# EAGLE design Amalgam (EAGLE 7.5.0)

## Sheet 1 of 5
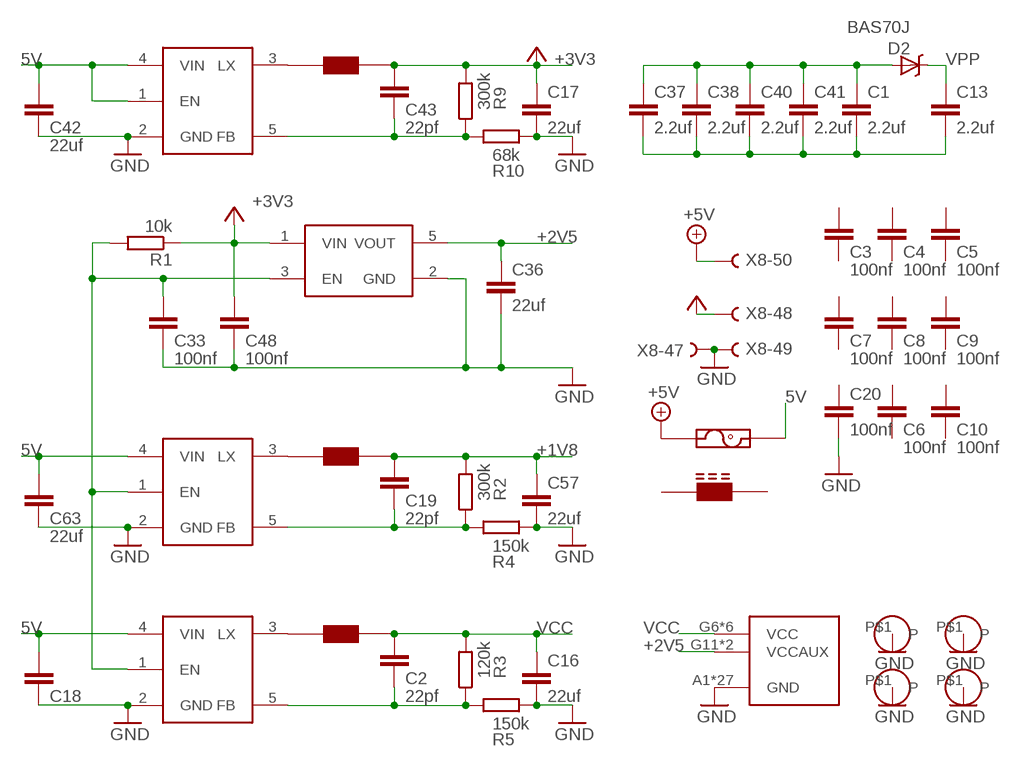
[diagram p0: schematic, sheet 1]

### Parts
C1  2.2uf  C-EUC0603  [C0603]
C2  22pf  C-EUC0402  [C0402]
C3  100nf  C-EUC0402  [C0402]
C4  100nf  C-EUC0402  [C0402]
C5  100nf  C-EUC0402  [C0402]
C6  100nf  C-EUC0402  [C0402]
C7  100nf  C-EUC0402  [C0402]
C8  100nf  C-EUC0402  [C0402]
C9  100nf  C-EUC0402  [C0402]
C10  100nf  C-EUC0402  [C0402]
C13  2.2uf  C-EUC0603  [C0603]
C16  22uf  C-EUC0603  [C0603]
C17  22uf  C-EUC0603  [C0603]
C18  22uf  C-EUC0402  [C0402]
C19  22pf  C-EUC0402  [C0402]
C20  100nf  C-EUC0402  [C0402]
C33  100nf  C-EUC0402  [C0402]
C36  22uf  C-EUC0603  [C0603]
C37  2.2uf  C-EUC0603  [C0603]
C38  2.2uf  C-EUC0603  [C0603]
C40  2.2uf  C-EUC0603  [C0603]
C41  2.2uf  C-EUC0603  [C0603]
C42  22uf  C-EUC0402  [C0402]
C43  22pf  C-EUC0402  [C0402]
C48  100nf  C-EUC0402  [C0402]
C57  22uf  C-EUC0603  [C0603]
C63  22uf  C-EUC0402  [C0402]
D2  BAS70J  [SOD-323]
IC7  NCP114  [TSOP-5/SOT23-5]
R1  10k  R-EU_R0402  [R0402]
R2  300k  R-EU_R0402  [R0402]
R3  120k  R-EU_R0402  [R0402]
R4  150k  R-EU_R0402  [R0402]
R5  150k  R-EU_R0402  [R0402]
R9  300k  R-EU_R0402  [R0402]
R10  68k  R-EU_R0402  [R0402]
U$1  PTC-1206  [1206]
U$7  HOLE-2.5MM  [2.5MM-HOLE]
U$12  AP3429/A  [TSOP-5/SOT23-5]
U$13  AP3429/A  [TSOP-5/SOT23-5]
U$14  LFE5-XX256CABGA256  [CABGA256]
U$15  HOLE-2.5MM  [2.5MM-HOLE]
U$16  HOLE-2.5MM  [2.5MM-HOLE]
U$17  HOLE-2.5MM  [2.5MM-HOLE]
U$18  NRS4018  [NRC4018]
U$19  NRS4018  [NRC4018]
U$20  AP3429/A  [TSOP-5/SOT23-5]
U$21  FERRITE_BEAD1206  [1206]
U$23  NRS4018  [NRC4018]
X8  1296-T50  [1296-50]

### Nets
5V: C18.2 C42.2 C63.2 U$1.2 U$12.4(VIN) U$13.4(VIN) U$20.1(EN) U$20.4(VIN) ; also sheet 5
+1V8: C19.2 C57.1 R2.2 U$19.P$2 ; also sheet 2
+2V5: C36.1 IC7.5(VOUT) U$14.G11(VCCAUX) U$14.L7(VCCAUX)
+3V3: C17.1 C43.2 C48.2 IC7.1(VIN) R1.1 R9.2 U$23.P$2 X8.48 ; also sheet 2,3,4,5
+5V: U$1.1 X8.50 ; also sheet 3,4,5
GND: C16.2 C17.2 C18.1 C20.2 C33.1 C36.2 C42.1 C48.1 C57.2 C63.1 IC7.2(GND) R4.2 R5.2 R10.2 U$7.P$1(P) U$12.2(GND) U$13.2(GND) U$14.A1(GND) U$14.A16(GND) U$14.D2(GND) U$14.D15(GND) U$14.F8(GND) U$14.F9(GND) U$14.G8(GND) U$14.G10(GND) U$14.H1(GND) U$14.H8(GND) U$14.H9(GND) U$14.H10(GND) U$14.H16(GND) U$14.J8(GND) U$14.J9(GND) U$14.J10(GND) U$14.K6(GND) U$14.K7(GND) U$14.K8(GND) U$14.K9(GND) U$14.K10(GND) U$14.N2(GND) U$14.N15(GND) U$14.T1(GND) U$14.T5(GND) U$14.T12(GND) U$14.T16(GND) U$15.P$1(P) U$16.P$1(P) U$17.P$1(P) U$20.2(GND) X8.47 X8.49 ; also sheet 2,3,4,5
N$3: C33.2 IC7.3(EN) R1.2 U$12.1(EN) U$13.1(EN)
N$47: C19.1 R2.1 R4.1 U$12.5(FB)
N$56: U$13.3(LX) U$18.P$1
N$61: U$12.3(LX) U$19.P$1
N$91: C2.1 R3.1 R5.1 U$13.5(FB)
N$93: C43.1 R9.1 R10.1 U$20.5(FB)
N$94: U$20.3(LX) U$23.P$1
N$96: C1.2 C13.2 C37.2 C38.2 C40.2 C41.2
N$97: C1.1 C37.1 C38.1 C40.1 C41.1 D2.A
VCC: C2.2 C16.1 R3.2 U$14.G6(VCC) U$14.G7(VCC) U$14.G9(VCC) U$14.L8(VCC) U$14.L9(VCC) U$14.L10(VCC) U$18.P$2
VPP: C13.1 D2.C
Unconnected: C3.1 C3.2 C4.1 C4.2 C5.1 C5.2 C6.1 C6.2 C7.1 C7.2 C8.1 C8.2 C9.1 C9.2 C10.1 C10.2 C20.1 IC7.4(NC) U$21.1 U$21.2 X8.1 X8.2 X8.3 X8.4 X8.9 X8.10 X8.11 X8.12 X8.18 X8.30 X8.31 X8.32 X8.33 X8.34 X8.35 X8.36 X8.37 X8.38 X8.39 X8.40 X8.41 X8.42 X8.43 X8.44 X8.45 X8.46

## Sheet 2 of 5
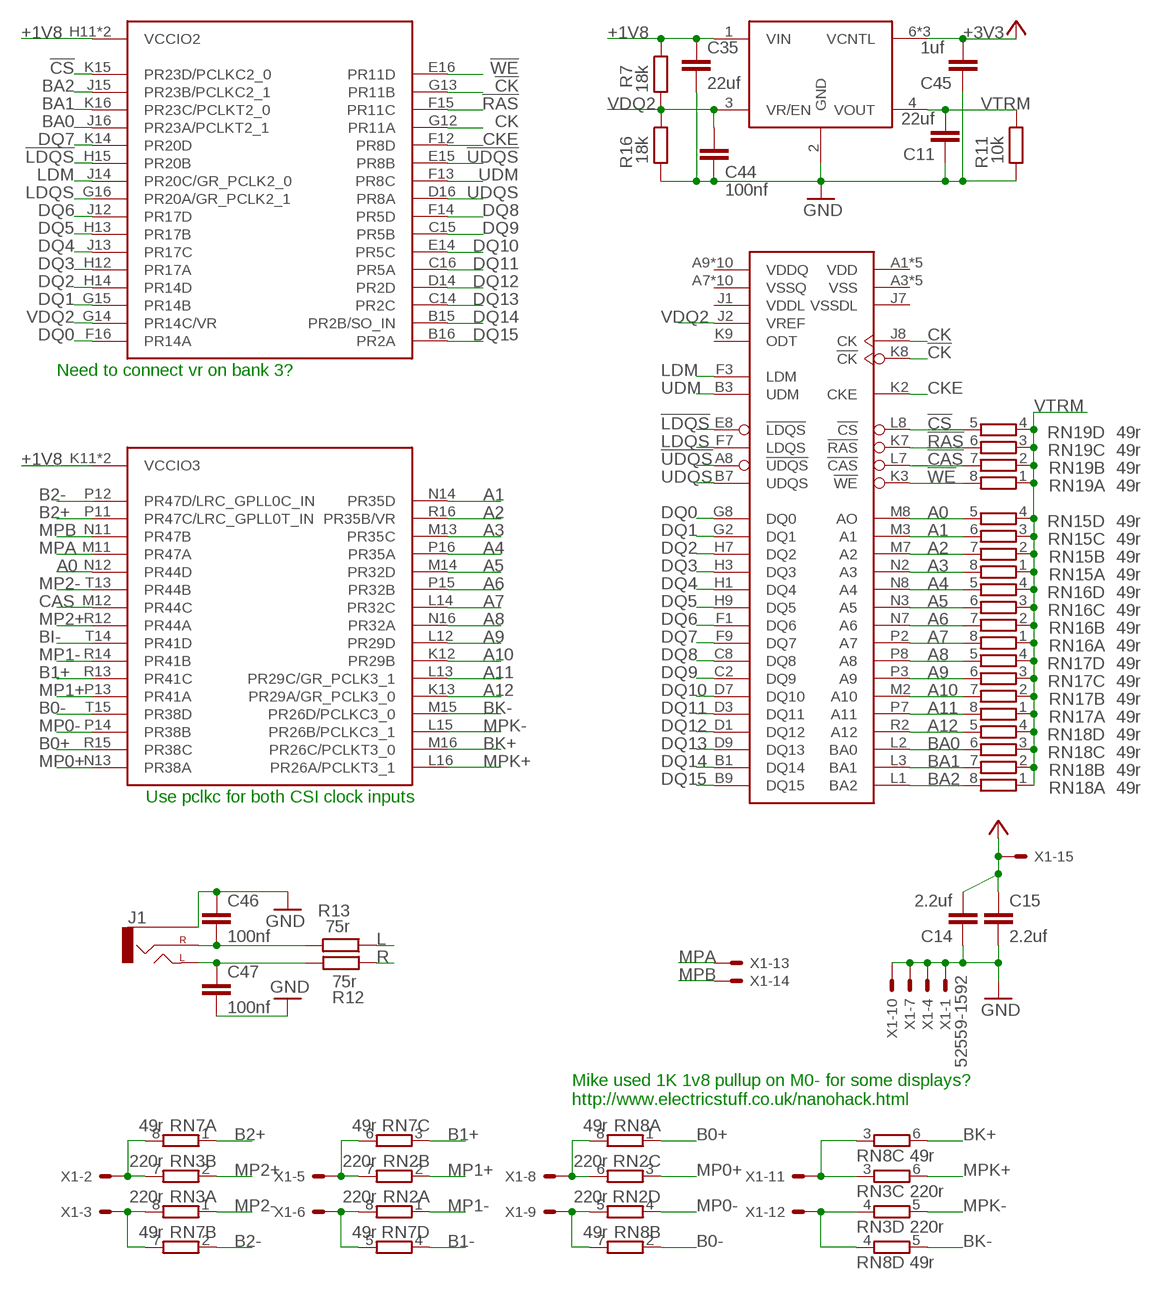
[diagram p1: schematic, sheet 2]

### Parts
C11  22uf  C-EUC0603  [C0603]
C14  2.2uf  C-EUC0603  [C0603]
C15  2.2uf  C-EUC0603  [C0603]
C35  22uf  C-EUC0603  [C0603]
C44  100nf  C-EUC0402  [C0402]
C45  1uf  C-EUC0402  [C0402]
C46  100nf  C-EUC0603  [C0603]
C47  100nf  C-EUC0603  [C0603]
J1  AUDIO_JACK_2.5MM_2.5MM_SMD  [STEREOJACK2.5MM]
R7  18k  R-EU_R0402  [R0402]
R11  10k  R-EU_R0402  [R0402]
R12  75r  R-EU_R0402  [R0402]
R13  75r  R-EU_R0402  [R0402]
R16  18k  R-EU_R0402  [R0402]
RN2  220r  4R-NEXB38V  [EXB38V]
RN3  220r  4R-NEXB38V  [EXB38V]
RN7  49r  4R-NEXB38V  [EXB38V]
RN8  49r  4R-NEXB38V  [EXB38V]
RN15  49r  4R-NEXB38V  [EXB38V]
RN16  49r  4R-NEXB38V  [EXB38V]
RN17  49r  4R-NEXB38V  [EXB38V]
RN18  49r  4R-NEXB38V  [EXB38V]
RN19  49r  4R-NEXB38V  [EXB38V]
U$4  DDR2  [WBGA-84]
U$22  AP2303  [SOIC-8-NARROW]
X1  52559-1592  [52559-1592]

### Nets
!CAS: RN19.7 U$4.L7(!CAS)
!CK: U$4.K8(!CK) U$14.G13(PR11B)
!CS: RN19.5 U$4.L8(!CS) U$14.K15(PR23D/PCLKC2_0)
!LDQS: U$4.E8(!LDQS) U$14.H15(PR20B)
!RAS: RN19.6 U$4.K7(!RAS) U$14.F15(PR11C)
!UDQS: U$4.A8(!UDQS) U$14.E15(PR8B)
!WE: RN19.8 U$4.K3(!WE) U$14.E16(PR11D)
+1V8: C35.1 R7.1 U$14.H11(VCCIO2) U$14.J11(VCCIO2) U$14.K11(VCCIO3) U$14.L11(VCCIO3) U$22.1(VIN) ; also sheet 1
+3V3: C14.2 C15.1 C45.2 U$22.6(VCNTL) U$22.7(VCNTL) U$22.8(VCNTL) X1.15 ; also sheet 1,3,4,5
A0: RN15.5 U$4.M8(AO) U$14.N12(PR44D)
A1: RN15.6 U$4.M3(A1) U$14.N14(PR35D)
A2: RN15.7 U$4.M7(A2) U$14.R16(PR35B/VR)
A3: RN15.8 U$4.N2(A3) U$14.M13(PR35C)
A4: RN16.5 U$4.N8(A4) U$14.P16(PR35A)
A5: RN16.6 U$4.N3(A5) U$14.M14(PR32D)
A6: RN16.7 U$4.N7(A6) U$14.P15(PR32B)
A7: RN16.8 U$4.P2(A7) U$14.L14(PR32C)
A8: RN17.5 U$4.P8(A8) U$14.N16(PR32A)
A9: RN17.6 U$4.P3(A9) U$14.L12(PR29D)
A10: RN17.7 U$4.M2(A10) U$14.K12(PR29B)
A11: RN17.8 U$4.P7(A11) U$14.L13(PR29C/GR_PCLK3_1)
A12: RN18.5 U$4.R2(A12) U$14.K13(PR29A/GR_PCLK3_0)
B0+: RN8.1 U$14.R15(PR38C)
B0-: RN8.2 U$14.T15(PR38D)
B1+: RN7.3 U$14.R13(PR41C)
B1-: RN7.4
B2+: RN7.1 U$14.P11(PR47C/LRC_GPLL0T_IN)
B2-: RN7.2 U$14.P12(PR47D/LRC_GPLL0C_IN)
BA0: RN18.6 U$4.L2(BA0) U$14.J16(PR23A/PCLKT2_1)
BA1: RN18.7 U$4.L3(BA1) U$14.K16(PR23C/PCLKT2_0)
BA2: RN18.8 U$4.L1(BA2) U$14.J15(PR23B/PCLKC2_1)
BI-: U$14.T14(PR41D)
BK+: RN8.6 U$14.M16(PR26C/PCLKT3_0)
BK-: RN8.5 U$14.M15(PR26D/PCLKC3_0)
CAS: U$14.M12(PR44C)
CK: U$4.J8(CK) U$14.G12(PR11A)
CKE: U$4.K2(CKE) U$14.F12(PR8D)
DQ0: U$4.G8(DQ0) U$14.F16(PR14A)
DQ1: U$4.G2(DQ1) U$14.G15(PR14B)
DQ2: U$4.H7(DQ2) U$14.H14(PR14D)
DQ3: U$4.H3(DQ3) U$14.H12(PR17A)
DQ4: U$4.H1(DQ4) U$14.J13(PR17C)
DQ5: U$4.H9(DQ5) U$14.H13(PR17B)
DQ6: U$4.F1(DQ6) U$14.J12(PR17D)
DQ7: U$4.F9(DQ7) U$14.K14(PR20D)
DQ8: U$4.C8(DQ8) U$14.F14(PR5D)
DQ9: U$4.C2(DQ9) U$14.C15(PR5B)
DQ10: U$4.D7(DQ10) U$14.E14(PR5C)
DQ11: U$4.D3(DQ11) U$14.C16(PR5A)
DQ12: U$4.D1(DQ12) U$14.D14(PR2D)
DQ13: U$4.D9(DQ13) U$14.C14(PR2C)
DQ14: U$4.B1(DQ14) U$14.B15(PR2B/SO_IN)
DQ15: U$4.B9(DQ15) U$14.B16(PR2A)
GND: C11.1 C14.1 C15.2 C35.2 C44.1 C45.1 C46.1 C47.2 J1.5(SLEEVE) R11.2 R16.2 U$22.2(GND) X1.1 X1.4 X1.7 X1.10 ; also sheet 1,3,4,5
L: R13.1 ; also sheet 5
LDM: U$4.F3(LDM) U$14.J14(PR20C/GR_PCLK2_0)
LDQS: U$4.F7(LDQS) U$14.G16(PR20A/GR_PCLK2_1)
MP0+: RN2.3 U$14.N13(PR38A)
MP0-: RN2.4 U$14.P14(PR38B)
MP1+: RN2.2 U$14.P13(PR41A)
MP1-: RN2.1 U$14.R14(PR41B)
MP2+: RN3.2 U$14.R12(PR44A)
MP2-: RN3.1 U$14.T13(PR44B)
MPA: U$14.M11(PR47A) X1.13
MPB: U$14.N11(PR47B) X1.14
MPK+: RN3.6 U$14.L16(PR26A/PCLKT3_1)
MPK-: RN3.5 U$14.L15(PR26B/PCLKC3_1)
N$8: RN3.3 RN8.3 X1.11
N$9: RN3.4 RN8.4 X1.12
N$19: RN2.6 RN8.8 X1.8
N$20: RN2.5 RN8.7 X1.9
N$22: RN2.7 RN7.6 X1.5
N$25: RN2.8 RN7.5 X1.6
N$26: RN3.8 RN7.7 X1.3
N$30: RN3.7 RN7.8 X1.2
N$92: C46.2 J1.4(RIGHT) R13.2
N$98: C47.1 J1.1(LEFT) R12.1
R: R12.2 ; also sheet 5
UDM: U$4.B3(UDM) U$14.F13(PR8C)
UDQS: U$4.B7(UDQS) U$14.D16(PR8A)
VDQ2: C44.2 R7.2 R16.1 U$4.J2(VREF) U$14.G14(PR14C/VR) U$22.3(VR/EN)
VTRM: C11.2 R11.1 RN15.1 RN15.2 RN15.3 RN15.4 RN16.1 RN16.2 RN16.3 RN16.4 RN17.1 RN17.2 RN17.3 RN17.4 RN18.1 RN18.2 RN18.3 RN18.4 RN19.1 RN19.2 RN19.3 RN19.4 U$22.4(VOUT)
Unconnected: U$4.A1(VDD) U$4.A2(NC) U$4.A3(VSS) U$4.A7(VSSQ) U$4.A9(VDDQ) U$4.B2(VSSQ) U$4.B8(VSSQ) U$4.C1(VDDQ) U$4.C3(VDDQ) U$4.C7(VDDQ) U$4.C9(VDDQ) U$4.D2(VSSQ) U$4.D8(VSSQ) U$4.E1(VDD) U$4.E2(NC) U$4.E3(VSS) U$4.E7(VSSQ) U$4.E9(VDDQ) U$4.F2(VSSQ) U$4.F8(VSSQ) U$4.G1(VDDQ) U$4.G3(VDDQ) U$4.G7(VDDQ) U$4.G9(VDDQ) U$4.H2(VSSQ) U$4.H8(VSSQ) U$4.J1(VDDL) U$4.J3(VSS) U$4.J7(VSSDL) U$4.J9(VDD) U$4.K9(ODT) U$4.M9(VDD) U$4.N1(VSS) U$4.P9(VSS) U$4.R1(VDD) U$4.R3(NC) U$4.R7(NC) U$4.R8(NC) U$22.5(NC)

### Notes on the sheet
- Need to connect vr on bank 3?
- Use pclkc for both CSI clock inputs
- Mike used 1K 1v8 pullup on M0- for some displays?
  http://www.electricstuff.co.uk/nanohack.html

## Sheet 3 of 5
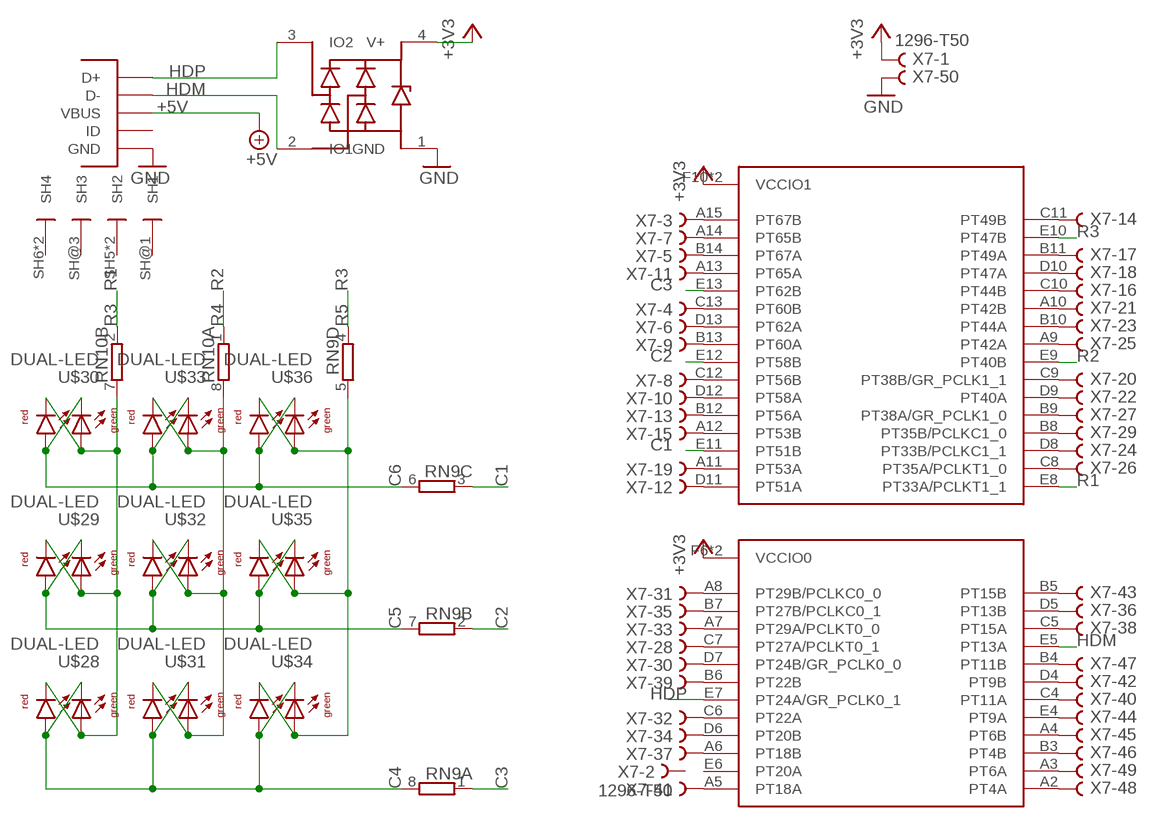
[diagram p2: schematic, sheet 3]

### Parts
ESD1  PRTR5V0U2X  [SOT143B]
RN9  4R-NEXB38V  [EXB38V]
RN10  4R-NEXB38V  [EXB38V]
U$11  FCI-MICROUSB-B-PEG  [MICROUSB-B-PEG]
U$28  DUAL-LED  [DUAL-0603]
U$29  DUAL-LED  [DUAL-0603]
U$30  DUAL-LED  [DUAL-0603]
U$31  DUAL-LED  [DUAL-0603]
U$32  DUAL-LED  [DUAL-0603]
U$33  DUAL-LED  [DUAL-0603]
U$34  DUAL-LED  [DUAL-0603]
U$35  DUAL-LED  [DUAL-0603]
U$36  DUAL-LED  [DUAL-0603]
X7  1296-T50  [1296-50]

### Nets
+3V3: ESD1.4(V+) U$14.F6(VCCIO0) U$14.F7(VCCIO0) U$14.F10(VCCIO1) U$14.F11(VCCIO1) X7.1 ; also sheet 1,2,4,5
+5V: U$11.P$1(VBUS) ; also sheet 1,4,5
C1: RN9.3 U$14.E11(PT51B)
C2: RN9.2 U$14.E12(PT58B)
C3: RN9.1 U$14.E13(PT62B)
C4: RN9.8 U$28.A1(AR) U$28.C2(CG) U$31.A1(AR) U$31.C2(CG) U$34.A1(AR) U$34.C2(CG)
C5: RN9.7 U$29.A1(AR) U$29.C2(CG) U$32.A1(AR) U$32.C2(CG) U$35.A1(AR) U$35.C2(CG)
C6: RN9.6 U$30.A1(AR) U$30.C2(CG) U$33.A1(AR) U$33.C2(CG) U$36.A1(AR) U$36.C2(CG)
GND: ESD1.1(GND) U$11.P$5(GND) X7.50 ; also sheet 1,2,4,5
HDM: ESD1.2(IO1) U$11.P$2(D-) U$14.E5(PT13A)
HDP: ESD1.3(IO2) U$11.P$3(D+) U$14.E7(PT24A/GR_PCLK0_1)
N$5: U$14.B3(PT4B) X7.46
N$39: U$14.A2(PT4A) X7.48
N$40: U$14.A15(PT67B) X7.3
N$51: U$14.B14(PT67A) X7.5
N$52: U$14.A14(PT65B) X7.7
N$69: U$14.B13(PT60A) X7.9
N$70: U$14.A13(PT65A) X7.11
N$71: U$14.B12(PT56A) X7.13
N$72: U$14.A12(PT53B) X7.15
N$73: U$14.B11(PT49A) X7.17
N$74: U$14.A11(PT53A) X7.19
N$75: U$14.C13(PT60B) X7.4
N$76: U$14.D13(PT62A) X7.6
N$77: U$14.C12(PT56B) X7.8
N$78: U$14.D12(PT58A) X7.10
N$79: U$14.A8(PT29B/PCLKC0_0) X7.31
N$80: U$14.A7(PT29A/PCLKT0_0) X7.33
N$81: U$14.B7(PT27B/PCLKC0_1) X7.35
N$82: U$14.A6(PT18B) X7.37
N$83: U$14.B6(PT22B) X7.39
N$84: U$14.A5(PT18A) X7.41
N$85: U$14.B5(PT15B) X7.43
N$86: U$14.C7(PT27A/PCLKT0_1) X7.28
N$87: U$14.D7(PT24B/GR_PCLK0_0) X7.30
N$88: U$14.C6(PT22A) X7.32
N$89: U$14.D6(PT20B) X7.34
N$90: U$14.D5(PT13B) X7.36
N$106: U$14.B4(PT11B) X7.47
N$107: U$14.A4(PT6B) X7.45
N$108: U$14.A3(PT6A) X7.49
N$130: U$14.D11(PT51A) X7.12
N$131: U$14.C11(PT49B) X7.14
N$132: U$14.C10(PT44B) X7.16
N$133: U$14.D10(PT47A) X7.18
N$134: U$14.A10(PT42B) X7.21
N$135: U$14.B10(PT44A) X7.23
N$136: U$14.A9(PT42A) X7.25
N$137: U$14.B9(PT38A/GR_PCLK1_0) X7.27
N$138: U$14.B8(PT35B/PCLKC1_0) X7.29
N$139: U$14.C9(PT38B/GR_PCLK1_1) X7.20
N$140: U$14.D9(PT40A) X7.22
N$141: U$14.D8(PT33B/PCLKC1_1) X7.24
N$142: U$14.C8(PT35A/PCLKT1_0) X7.26
N$143: U$14.C5(PT15A) X7.38
N$144: U$14.C4(PT11A) X7.40
N$145: U$14.D4(PT9B) X7.42
N$146: U$14.E4(PT9A) X7.44
R1: RN10.2 U$14.E8(PT33A/PCLKT1_1)
R2: RN10.1 U$14.E9(PT40B)
R3: RN9.4 RN10.7 U$14.E10(PT47B) U$28.A2(AG) U$28.C1(CR) U$29.A2(AG) U$29.C1(CR) U$30.A2(AG) U$30.C1(CR)
R4: RN10.8 U$31.A2(AG) U$31.C1(CR) U$32.A2(AG) U$32.C1(CR) U$33.A2(AG) U$33.C1(CR)
R5: RN9.5 U$34.A2(AG) U$34.C1(CR) U$35.A2(AG) U$35.C1(CR) U$36.A2(AG) U$36.C1(CR)
Unconnected: RN10.3 RN10.4 RN10.5 RN10.6 U$11.P$4(ID) U$11.SH5(SH2) U$11.SH6(SH4) U$11.SH@1(SH1) U$11.SH@2(SH2) U$11.SH@3(SH3) U$11.SH@4(SH4) U$14.E6(PT20A) X7.2

## Sheet 4 of 5
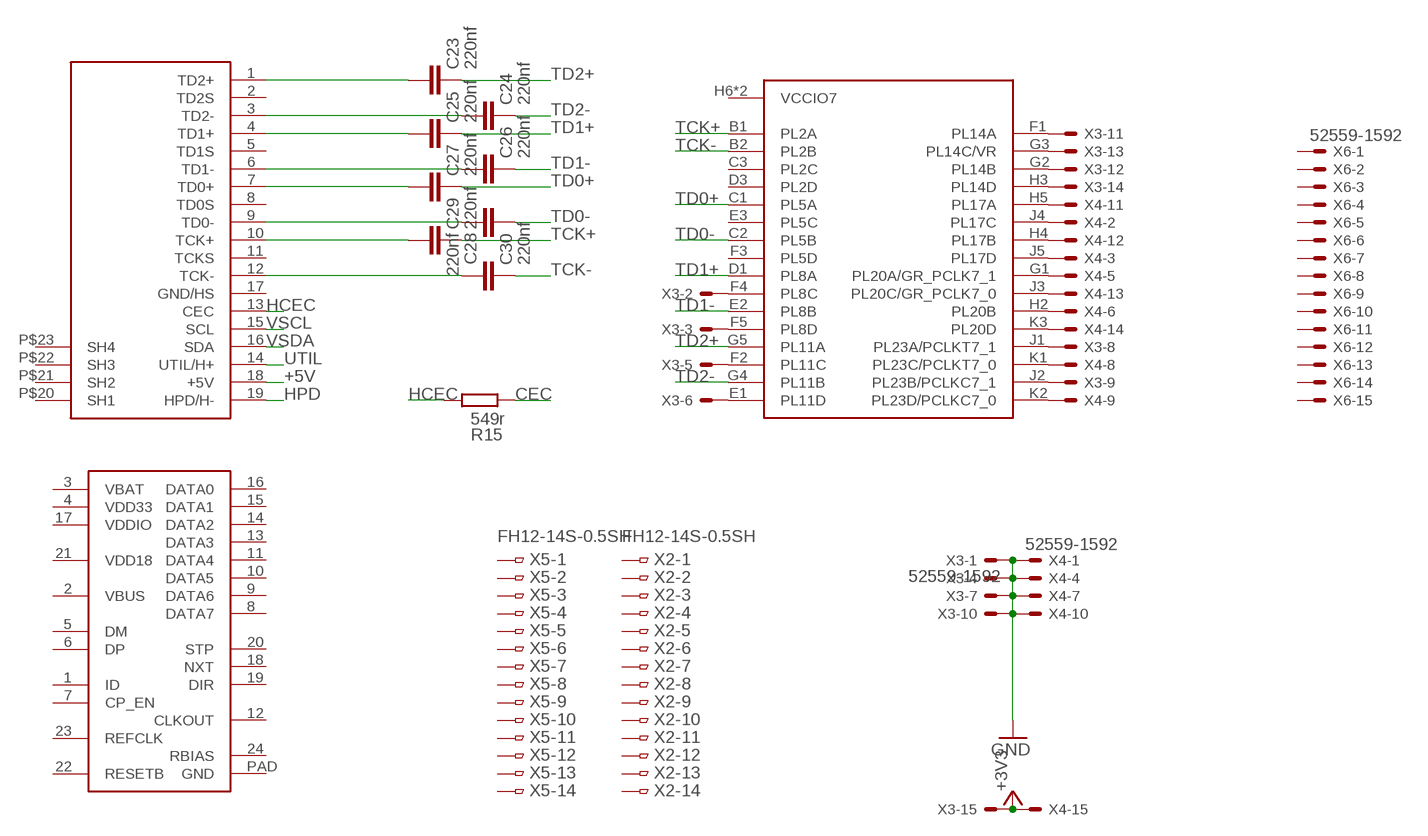
[diagram p3: schematic, sheet 4]

### Parts
C23  220nf  C-EUC0402  [C0402]
C24  220nf  C-EUC0402  [C0402]
C25  220nf  C-EUC0402  [C0402]
C26  220nf  C-EUC0402  [C0402]
C27  220nf  C-EUC0402  [C0402]
C28  220nf  C-EUC0402  [C0402]
C29  220nf  C-EUC0402  [C0402]
C30  220nf  C-EUC0402  [C0402]
R15  549r  R-EU_R0402  [R0402]
U$9  HD10-001_HDMIMINI-HDMI  [MINI-HDMI]
U$25  USB3318-QFN24  [24-QFN]
X2  FH12-14S-0.5SH  [FH12-14S-0.5SH]
X3  52559-1592  [52559-1592]
X4  52559-1592  [52559-1592]
X5  FH12-14S-0.5SH  [FH12-14S-0.5SH]
X6  52559-1592  [52559-1592]

### Nets
+3V3: X3.15 X4.15 ; also sheet 1,2,3,5
+5V: U$9.18(+5V) ; also sheet 1,3,5
CEC: R15.2 ; also sheet 5
GND: X3.1 X3.4 X3.7 X3.10 X4.1 X4.4 X4.7 X4.10 ; also sheet 1,2,3,5
HCEC: R15.1 U$9.13(CEC)
HPD: U$9.19(HPD/H-) ; also sheet 5
N$6: U$14.K3(PL20D) X4.14
N$11: U$14.J3(PL20C/GR_PCLK7_0) X4.13
N$13: U$14.J1(PL23A/PCLKT7_1) X3.8
N$14: U$14.J2(PL23B/PCLKC7_1) X3.9
N$15: U$14.K1(PL23C/PCLKT7_0) X4.8
N$16: U$14.K2(PL23D/PCLKC7_0) X4.9
N$17: U$14.H2(PL20B) X4.6
N$21: U$14.G1(PL20A/GR_PCLK7_1) X4.5
N$23: U$14.J5(PL17D) X4.3
N$24: U$14.J4(PL17C) X4.2
N$27: U$14.H4(PL17B) X4.12
N$28: U$14.H5(PL17A) X4.11
N$29: U$14.H3(PL14D) X3.14
N$31: U$14.G3(PL14C/VR) X3.13
N$32: U$14.G2(PL14B) X3.12
N$33: U$14.F1(PL14A) X3.11
N$34: U$14.E1(PL11D) X3.6
N$35: U$14.F2(PL11C) X3.5
N$36: U$14.F5(PL8D) X3.3
N$42: C23.2 U$9.1(TD2+)
N$44: C24.2 U$9.3(TD2-)
N$45: C25.2 U$9.4(TD1+)
N$49: C26.2 U$9.6(TD1-)
N$50: C27.2 U$9.7(TD0+)
N$54: C28.1 U$9.9(TD0-)
N$55: C29.2 U$9.10(TCK+)
N$57: U$14.F4(PL8C) X3.2
N$58: C30.2 U$9.12(TCK-)
TCK+: C29.1 U$14.B1(PL2A)
TCK-: C30.1 U$14.B2(PL2B)
TD0+: C27.1 U$14.C1(PL5A)
TD0-: C28.2 U$14.C2(PL5B)
TD1+: C25.1 U$14.D1(PL8A)
TD1-: C26.1 U$14.E2(PL8B)
TD2+: C23.1 U$14.G5(PL11A)
TD2-: C24.1 U$14.G4(PL11B)
UTIL: U$9.14(UTIL/H+)
VSCL: U$9.15(SCL) ; also sheet 5
VSDA: U$9.16(SDA) ; also sheet 5
Unconnected: U$9.2(TD2S) U$9.5(TD1S) U$9.8(TD0S) U$9.11(TCKS) U$9.17(GND/HS) U$9.P$20(SH1) U$9.P$21(SH2) U$9.P$22(SH3) U$9.P$23(SH4) U$14.C3(PL2C) U$14.D3(PL2D) U$14.E3(PL5C) U$14.F3(PL5D) U$14.H6(VCCIO7) U$14.H7(VCCIO7) U$25.1(ID) U$25.2(VBUS) U$25.5(DM) U$25.6(DP) U$25.7(CP_EN) U$25.8(DATA7) U$25.9(DATA6) U$25.10(DATA5) U$25.11(DATA4) U$25.12(CLKOUT) U$25.13(DATA3) U$25.14(DATA2) U$25.15(DATA1) U$25.16(DATA0) U$25.18(NXT) U$25.19(DIR) U$25.20(STP) U$25.22(RESETB) U$25.23(REFCLK) U$25.24(RBIAS) X2.1 X2.2 X2.3 X2.4 X2.5 X2.6 X2.7 X2.8 X2.9 X2.10 X2.11 X2.12 X2.13 X2.14 X5.1 X5.2 X5.3 X5.4 X5.5 X5.6 X5.7 X5.8 X5.9 X5.10 X5.11 X5.12 X5.13 X5.14 X6.1 X6.2 X6.3 X6.4 X6.5 X6.6 X6.7 X6.8 X6.9 X6.10 X6.11 X6.12 X6.13 X6.14 X6.15

## Sheet 5 of 5
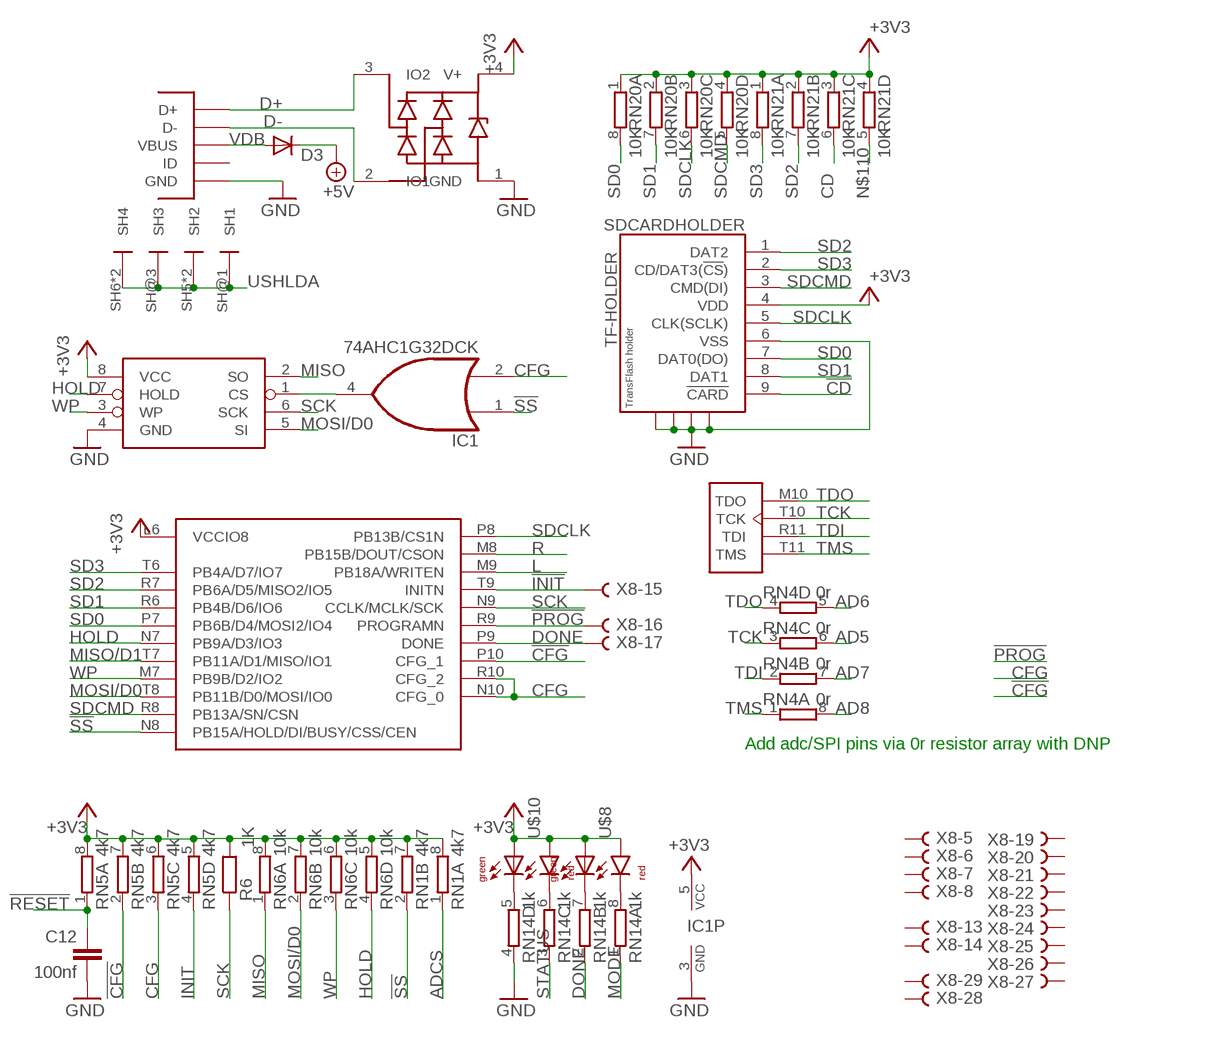
[diagram p4: schematic, sheet 5, part 1 of 2]
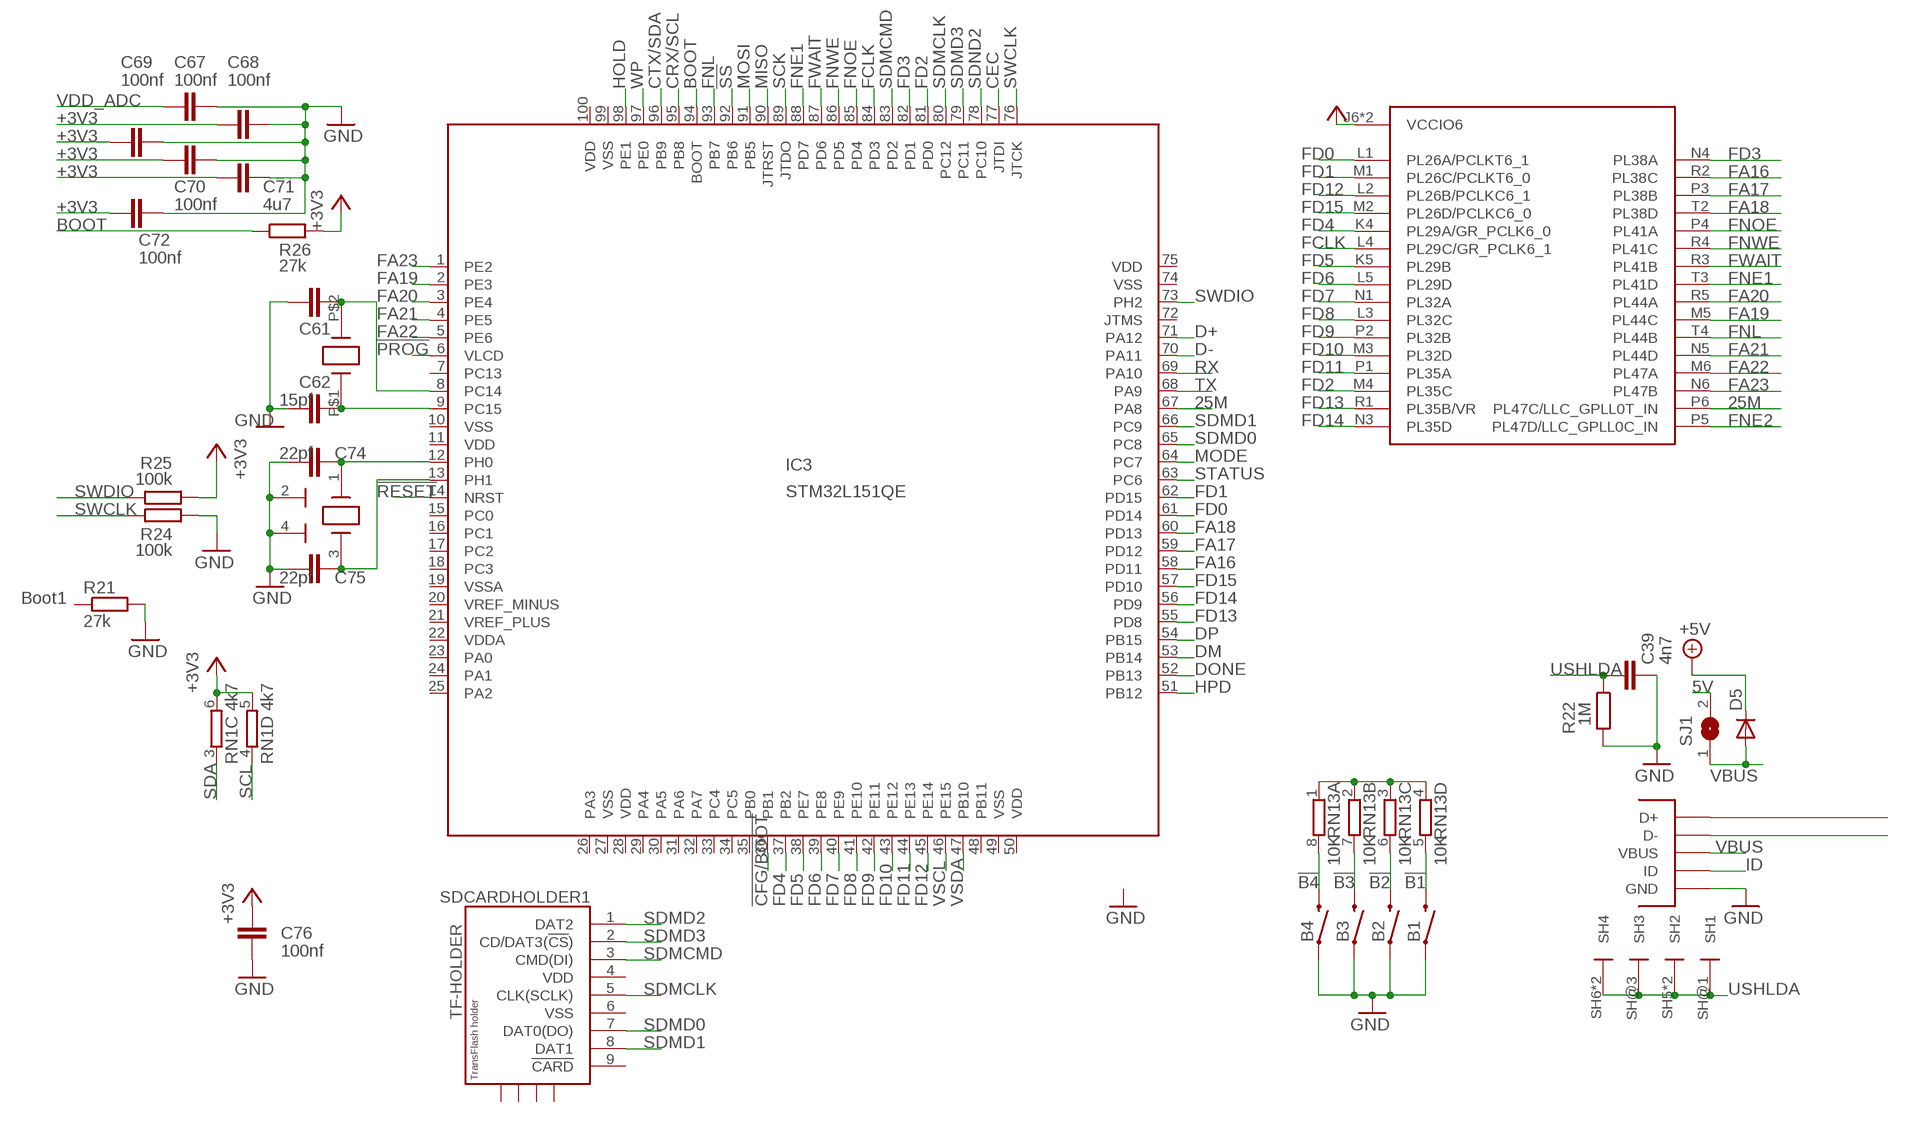
[diagram p5: schematic, sheet 5, part 2 of 2]

### Parts
B1  RS SWITCH  SWITCH-MOMENTARY-2SMD-1101NE  [TACTILE-SWITCH-1101NE]
B2  RS SWITCH  SWITCH-MOMENTARY-2SMD-1101NE  [TACTILE-SWITCH-1101NE]
B3  RS SWITCH  SWITCH-MOMENTARY-2SMD-1101NE  [TACTILE-SWITCH-1101NE]
B4  RS SWITCH  SWITCH-MOMENTARY-2SMD-1101NE  [TACTILE-SWITCH-1101NE]
C12  100nf  C-EUC0402  [C0402]
C39  4n7  C-EUC0402  [C0402]
C61  15pf  C-EUC0402  [C0402]
C62  15pf  C-EUC0402  [C0402]
C67  100nf  C-EUC0402  [C0402]
C68  100nf  C-EUC0402  [C0402]
C69  100nf  C-EUC0402  [C0402]
C70  100nf  C-EUC0402  [C0402]
C71  4u7  C-EUC0402  [C0402]
C72  100nf  C-EUC0402  [C0402]
C74  22pf  C-EUC0402  [C0402]
C75  22pf  C-EUC0402  [C0402]
C76  100nf  C-EUC0402  [C0402]
D3  DIODE-SOD123  [SOD123]
D5  DIODE-SOD123  [SOD123]
ESD2  PRTR5V0U2X  [SOT143B]
IC1  74AHC1G32DCK  [SC70-5]
IC3  STM32L151QE  [LQFP100_14X14]
R6  1K  R-EU_R0402  [R0402]
R21  27k  R-EU_R0402  [R0402]
R22  1M  R-EU_R0402  [R0402]
R24  100k  R-EU_R0402  [R0402]
R25  100k  R-EU_R0402  [R0402]
R26  27k  R-EU_R0402  [R0402]
RN1  4k7  4R-NEXB38V  [EXB38V]
RN4  0r  4R-NEXB38V  [EXB38V]
RN5  4k7  4R-NEXB38V  [EXB38V]
RN6  10k  4R-NEXB38V  [EXB38V]
RN13  10K  4R-NEXB38V  [EXB38V]
RN14  1k  4R-NEXB38V  [EXB38V]
RN20  10K  4R-NEXB38V  [EXB38V]
RN21  10K  4R-NEXB38V  [EXB38V]
SDCARDHOLDER  TF-HOLDER  [TF-PULL]
SDCARDHOLDER1  TF-HOLDER  [TF-PULL]
SJ1  SJ  [SJ]
U$2  AT25SDF041A  [SOIC-8-NARROW]
U$3  FC-135  [FC135]
U$5  FCI-MICROUSB-B-PEG  [MICROUSB-B-PEG]
U$6  FCI-MICROUSB-B-PEG  [MICROUSB-B-PEG]
U$8  DUAL-LED  [DUAL-0603]
U$10  DUAL-LED  [DUAL-0603]
Y3  12MZ  7M-25  [CRYSTAL-3.2X2.5]

### Nets
5V: SJ1.2 ; also sheet 1
25M: IC3.67(PA8) U$14.P6(PL47C/LLC_GPLL0T_IN)
!B1: B1.2 RN13.5
!B2: B2.2 RN13.6
!B3: B3.2 RN13.7
!B4: B4.2 RN13.8
!CD: SDCARDHOLDER.9(!CARD)
!CFG: RN5.2 U$14.P10(CFG_1)
!CFG/BOOT: IC3.36(PB1)
!INIT: U$14.T9(INITN) X8.15
!PROG: IC3.6(VLCD) U$14.R9(PROGRAMN) X8.16
!RESET: C12.1 IC3.14(NRST) RN5.1
!SS: IC1.1(I0) IC3.92(PB6) RN1.2 U$14.N8(PB15A/HOLD/DI/BUSY/CSS/CEN)
+3V3: C68.2 C69.2 C70.2 C71.2 C72.2 C76.1 ESD2.4(V+) IC1.5(VCC) R6.2 R25.1 R26.2 RN1.5 RN1.6 RN1.7 RN1.8 RN5.5 RN5.6 RN5.7 RN5.8 RN6.5 RN6.6 RN6.7 RN6.8 RN20.1 RN20.2 RN20.3 RN20.4 RN21.1 RN21.2 RN21.3 RN21.4 SDCARDHOLDER.4(VDD) U$2.8(VCC) U$8.A1(AR) U$8.A2(AG) U$10.A1(AR) U$10.A2(AG) U$14.J6(VCCIO6) U$14.J7(VCCIO6) U$14.L6(VCCIO8) ; also sheet 1,2,3,4
+5V: D3.C D5.C ; also sheet 1,3,4
AD5: RN4.6
AD6: RN4.5
AD7: RN4.7
AD8: RN4.8
ADCS: RN1.1
BOOT: IC3.94(BOOT) R26.1
CD: RN21.6
CEC: IC3.77(JTDI) ; also sheet 4
CFG: IC1.2(I1) RN5.3 U$14.N10(CFG_0) U$14.R10(CFG_2)
CRX/SCL: IC3.95(PB8)
CTX/SDA: IC3.96(PB9)
D+: ESD2.3(IO2) IC3.71(PA12) U$5.P$3(D+)
D-: ESD2.2(IO1) IC3.70(PA11) U$5.P$2(D-)
DM: IC3.53(PB14)
DONE: IC3.52(PB13) RN14.2 U$14.P9(DONE) X8.17
DP: IC3.54(PB15)
FA16: IC3.58(PD11) U$14.R2(PL38C)
FA17: IC3.59(PD12) U$14.P3(PL38B)
FA18: IC3.60(PD13) U$14.T2(PL38D)
FA19: IC3.2(PE3) U$14.M5(PL44C)
FA20: IC3.3(PE4) U$14.R5(PL44A)
FA21: IC3.4(PE5) U$14.N5(PL44D)
FA22: IC3.5(PE6) U$14.M6(PL47A)
FA23: IC3.1(PE2) U$14.N6(PL47B)
FCLK: IC3.84(PD3) U$14.L4(PL29C/GR_PCLK6_1)
FD0: IC3.61(PD14) U$14.L1(PL26A/PCLKT6_1)
FD1: IC3.62(PD15) U$14.M1(PL26C/PCLKT6_0)
FD2: IC3.81(PD0) U$14.M4(PL35C)
FD3: IC3.82(PD1) U$14.N4(PL38A)
FD4: IC3.37(PB2) U$14.K4(PL29A/GR_PCLK6_0)
FD5: IC3.38(PE7) U$14.K5(PL29B)
FD6: IC3.39(PE8) U$14.L5(PL29D)
FD7: IC3.40(PE9) U$14.N1(PL32A)
FD8: IC3.41(PE10) U$14.L3(PL32C)
FD9: IC3.42(PE11) U$14.P2(PL32B)
FD10: IC3.43(PE12) U$14.M3(PL32D)
FD11: IC3.44(PE13) U$14.P1(PL35A)
FD12: IC3.45(PE14) U$14.L2(PL26B/PCLKC6_1)
FD13: IC3.55(PD8) U$14.R1(PL35B/VR)
FD14: IC3.56(PD9) U$14.N3(PL35D)
FD15: IC3.57(PD10) U$14.M2(PL26D/PCLKC6_0)
FNE1: IC3.88(PD7) U$14.T3(PL41D)
FNE2: U$14.P5(PL47D/LLC_GPLL0C_IN)
FNL: IC3.93(PB7) U$14.T4(PL44B)
FNOE: IC3.85(PD4) U$14.P4(PL41A)
FNWE: IC3.86(PD5) U$14.R4(PL41C)
FWAIT: IC3.87(PD6) U$14.R3(PL41B)
GND: B1.1 B2.1 B3.1 B4.1 C12.2 C39.1 C61.1 C62.1 C67.1 C68.1 C69.1 C70.1 C71.1 C72.1 C74.1 C75.1 C76.2 ESD2.1(GND) IC1.3(GND) R21.2 R22.2 R24.1 RN14.4 SDCARDHOLDER.6(VSS) SDCARDHOLDER.S1 SDCARDHOLDER.S2 SDCARDHOLDER.S3 SDCARDHOLDER.S4 U$2.4(GND) U$5.P$5(GND) U$6.P$5(GND) Y3.2(GND) Y3.4(GND) ; also sheet 1,2,3,4
HOLD: IC3.98(PE1) RN6.4 U$2.7(HOLD) U$14.N7(PB9A/D3/IO3)
HPD: IC3.51(PB12) ; also sheet 4
ID: U$6.P$4(ID)
INIT: RN5.4
L: U$14.M9(PB18A/WRITEN) ; also sheet 2
MISO: IC3.90(JTRST) RN6.1 U$2.2(SO)
MISO/D1: U$14.T7(PB11A/D1/MISO/IO1)
MODE: IC3.64(PC7) RN14.1
MOSI: IC3.91(PB5)
MOSI/D0: RN6.2 U$2.5(SI) U$14.T8(PB11B/D0/MOSI/IO0)
N$1: C62.2 IC3.9(PC15) U$3.P$1(X1)
N$4: IC1.4(O) U$2.1(CS)
N$10: RN13.1 RN13.2 RN13.3 RN13.4
N$12: C61.2 IC3.8(PC14) U$3.P$2(X2)
N$18: U$6.P$3(D+)
N$41: U$6.P$2(D-)
N$43: RN14.5 U$10.C2(CG)
N$46: RN14.6 U$10.C1(CR)
N$48: RN14.7 U$8.C2(CG)
N$53: RN14.8 U$8.C1(CR)
N$60: C75.2 IC3.13(PH1) Y3.3(X2)
N$63: C74.2 IC3.12(PH0) Y3.1(X1)
N$110: RN21.5
R: U$14.M8(PB15B/DOUT/CSON) ; also sheet 2
RX: IC3.69(PA10)
SCK: IC3.89(JTDO) R6.1 U$2.6(SCK) U$14.N9(CCLK/MCLK/SCK)
SCL: RN1.4
SD0: RN20.8 SDCARDHOLDER.7(DAT0(DO)) U$14.P7(PB6B/D4/MOSI2/IO4)
SD1: RN20.7 SDCARDHOLDER.8(DAT1) U$14.R6(PB4B/D6/IO6)
SD2: RN21.7 SDCARDHOLDER.1(DAT2) U$14.R7(PB6A/D5/MISO2/IO5)
SD3: RN21.8 SDCARDHOLDER.2(CD/DAT3(!CS!)) U$14.T6(PB4A/D7/IO7)
SDA: RN1.3
SDCLK: RN20.6 SDCARDHOLDER.5(CLK(SCLK)) U$14.P8(PB13B/CS1N)
SDCMD: RN20.5 SDCARDHOLDER.3(CMD(DI)) U$14.R8(PB13A/SN/CSN)
SDMCLK: IC3.80(PC12) SDCARDHOLDER1.5(CLK(SCLK))
SDMCMD: IC3.83(PD2) SDCARDHOLDER1.3(CMD(DI))
SDMD0: IC3.65(PC8) SDCARDHOLDER1.7(DAT0(DO))
SDMD1: IC3.66(PC9) SDCARDHOLDER1.8(DAT1)
SDMD2: SDCARDHOLDER1.1(DAT2)
SDMD3: IC3.79(PC11) SDCARDHOLDER1.2(CD/DAT3(!CS!))
SDND2: IC3.78(PC10)
STATUS: IC3.63(PC6) RN14.3
SWCLK: IC3.76(JTCK) R24.2
SWDIO: IC3.73(PH2) R25.2
TCK: RN4.3 U$14.T10(TCK)
TDI: RN4.2 U$14.R11(TDI)
TDO: RN4.4 U$14.M10(TDO)
TMS: RN4.1 U$14.T11(TMS)
TX: IC3.68(PA9)
USHLDA: C39.2 R22.1 U$5.SH5(SH2) U$5.SH6(SH4) U$5.SH@1(SH1) U$5.SH@2(SH2) U$5.SH@3(SH3) U$5.SH@4(SH4) U$6.SH5(SH2) U$6.SH6(SH4) U$6.SH@1(SH1) U$6.SH@2(SH2) U$6.SH@3(SH3) U$6.SH@4(SH4)
VBUS: D5.A SJ1.1 U$6.P$1(VBUS)
VDB: D3.A U$5.P$1(VBUS)
VDD_ADC: C67.2
VSCL: IC3.46(PE15) ; also sheet 4
VSDA: IC3.47(PB10) ; also sheet 4
WP: IC3.97(PE0) RN6.3 U$2.3(WP) U$14.M7(PB9B/D2/IO2)
Unconnected: IC3.7(PC13) IC3.15(PC0) IC3.16(PC1) IC3.17(PC2) IC3.18(PC3) IC3.20(VREF_MINUS) IC3.21(VREF_PLUS) IC3.23(PA0) IC3.24(PA1) IC3.25(PA2) IC3.26(PA3) IC3.29(PA4) IC3.30(PA5) IC3.31(PA6) IC3.32(PA7) IC3.33(PC4) IC3.34(PC5) IC3.35(PB0) IC3.48(PB11) IC3.72(JTMS) R21.1 SDCARDHOLDER1.9(!CARD) SDCARDHOLDER1.S1 SDCARDHOLDER1.S2 SDCARDHOLDER1.S3 SDCARDHOLDER1.S4 U$5.P$4(ID) X8.5 X8.6 X8.7 X8.8 X8.13 X8.14 X8.19 X8.20 X8.21 X8.22 X8.23 X8.24 X8.25 X8.26 X8.27 X8.28 X8.29

### Notes on the sheet
- Boot1
- Add adc/SPI pins via 0r resistor array with DNP

## Power pins joined to a net without a drawn wire
GND: U$25.PAD(GND)
VBAT: U$25.3(VBAT)
VDD: IC3.11(VDD) IC3.28(VDD) IC3.50(VDD) IC3.75(VDD) IC3.100(VDD) SDCARDHOLDER1.4(VDD)
VDD18: U$25.21(VDD18)
VDD33: U$25.4(VDD33)
VDDA: IC3.22(VDDA)
VDDIO: U$25.17(VDDIO)
VSS: IC3.10(VSS) IC3.27(VSS) IC3.49(VSS) IC3.74(VSS) IC3.99(VSS) SDCARDHOLDER1.6(VSS)
VSSA: IC3.19(VSSA)

## Library data of the parts
B1-B4 = SparkFun-Electromechanical:SWITCH-MOMENTARY-2: Various NO switches- pushbuttons, reed, etc; PROD_ID: SWCH-00815
C1-C20 C23-C30 C33 C35-C48 C57 C61-C63 C67-C72 C74-C76 = rcl:C-EU: CAPACITOR, European symbol
D2 = ELL-i-DiscreteSemi:BAS70: Silicon Schottky Diodes General-purpose diode for high-speed switching. Maximum forward current 70 mA Maxiumum forward voltage drop Vf 0.410 mV Maximum reverse voltage 70V
D3 D5 = diode:DIODE-: DIODE
ESD1 ESD2 = amino:PRTR5V0U2X
IC1 = 74xx-little-us:74*1G32: 2-input OR gate
IC3 = stm32xx:STM32L15*E: STM32L1_Med_density_LQFP100 edit this description Auto generated by make-symbol-device-package-bsdl.ulp Rev. 44 Source: STM32L1_Med_density_LQFP100.bsd
IC7 = amino:NCP114
J1 = SparkFun-Connectors:AUDIO_JACK_2.5MM: Audio Jack 2.5mm variants of PTH and SMT audio jacks. SparkFun Products: SparkFun PicoBoard <https://www.sparkfun.com/products/11888>- 2.5mm SMD; PROD_ID: CONN-10062
R1-R7 R9-R13 R15 R16 R21 R22 R24-R26 = resistor:R-EU_: RESISTOR, European symbol
RN1-RN10 RN13-RN21 = resistor-dil:4R-N: Array Chip Resistor Source: RS Component / Phycomp; OC_FARNELL: unknown; OC_NEWARK: unknown
SDCARDHOLDER SDCARDHOLDER1 = sd-mmc:TF-HOLDER: TF / Micro SD socket is PUSH-PUSH type, the card can be pushed into and auto locked and pushed out by simply press the card. Surface Mounting type.
SJ1 = jumper:SJ: SMD solder JUMPER
U$1 = amino:PTC-1206
U$2 = amino:AT25SDF041A
U$3 = amino:FC-135
U$4 = amino:DDR2
U$5 U$6 U$11 = amino:FCI-MICROUSB-B-PEG
U$7 U$15-U$17 = amino:HOLE-2.5MM
U$8 U$10 U$28-U$36 = amino:DUAL-LED
U$9 = amino:HD10-001_HDMI
U$12 U$13 U$20 = amino:AP3429/A
U$14 = amino:LFE5-XX256
U$18 U$19 U$23 = amino:NRS4018
U$21 = amino:FERRITE_BEAD
U$22 = amino:AP2303
U$25 = amino:USB3318-QFN24
X1 X3 X4 X6 = con-molex:52559-1592: FFC/FPC-to-Board 0.50mm (.020") SMT, Vertical, ZIF Receptacle Source: http://www.molex.com/product/ffc/52559.html; OC_FARNELL: unknown; OC_NEWARK: unknown
X2 X5 = con-hirose:FH12-14S-0.5S: 0.5mm Pitch Connectors For FPC/FFC Source: Data sheet <http://www.hirose.co.jp/cataloge_hp/e58605370.pdf>; MPN: MC34827; OC_FARNELL: 1324544; OC_NEWARK: 41P0493
X7 X8 = con-leotronics:1296-T50: 1.27mm SINGLE ROW FEMALE SOCKET Source: http://www.leotronics.co.uk/Conexcon/Data%20Sheets/sec.%20A/1296ing.pdf; OC_FARNELL: unknown; OC_NEWARK: unknown
Y3 = amino:7M-25

## Board
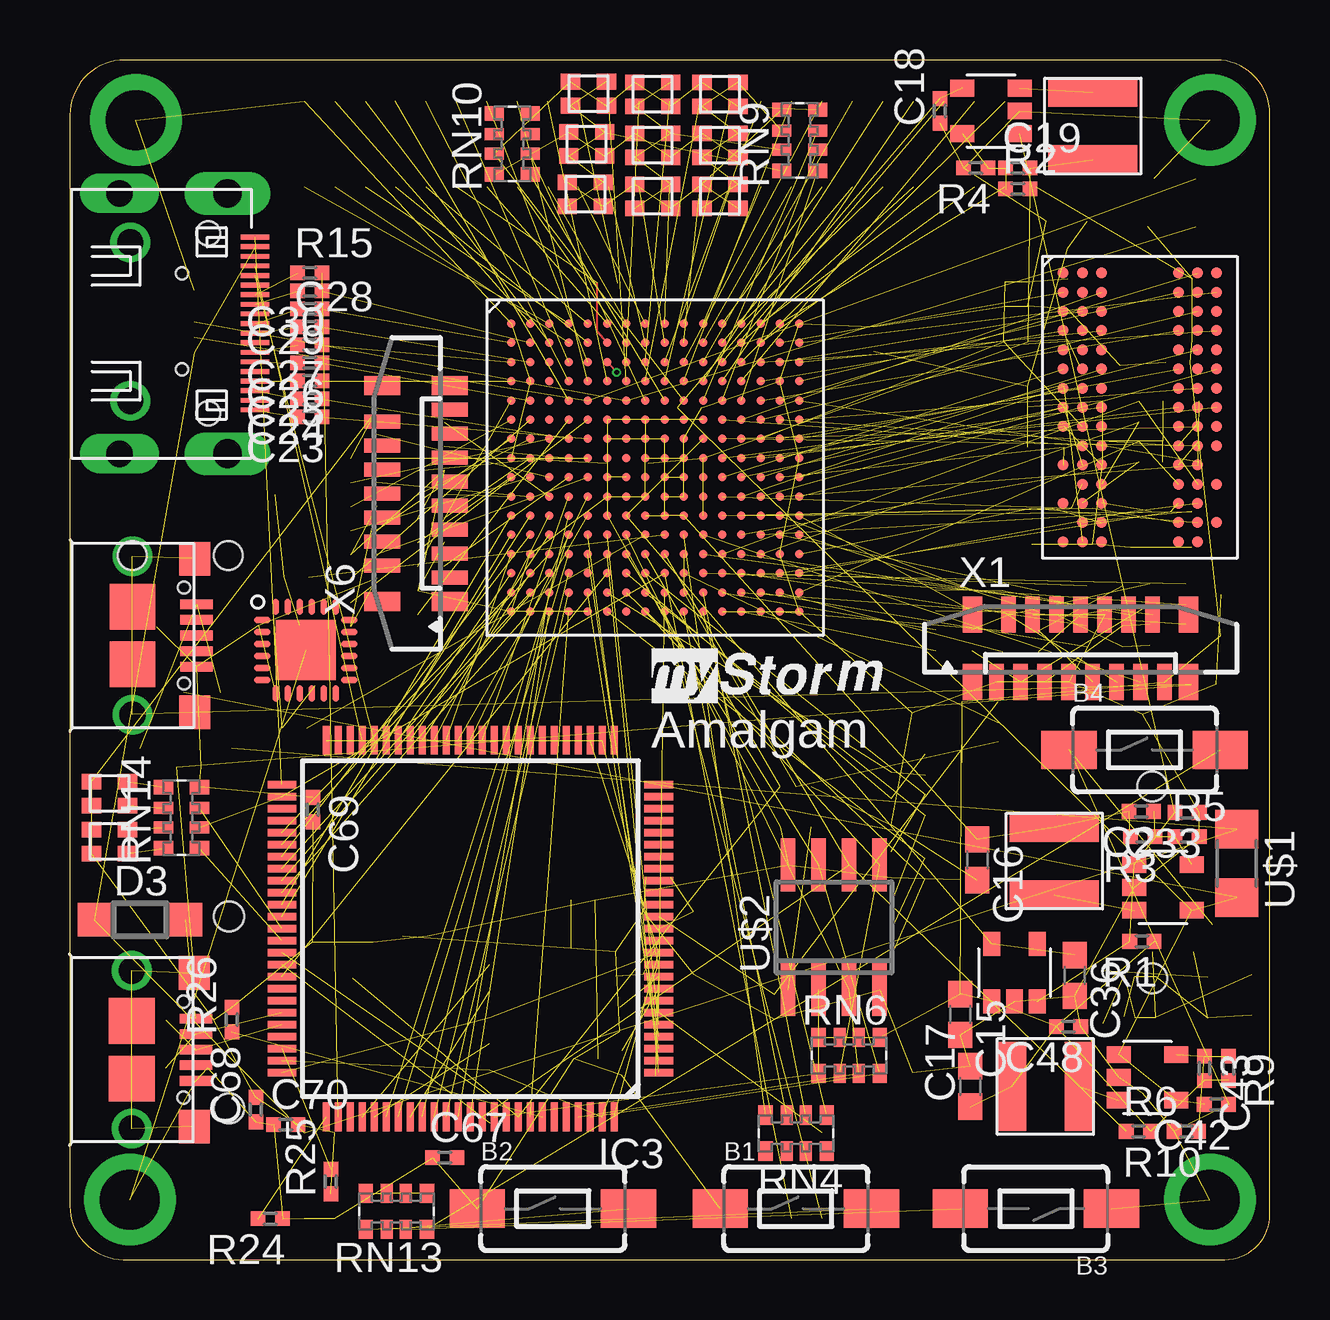
[diagram p6: board, top side]
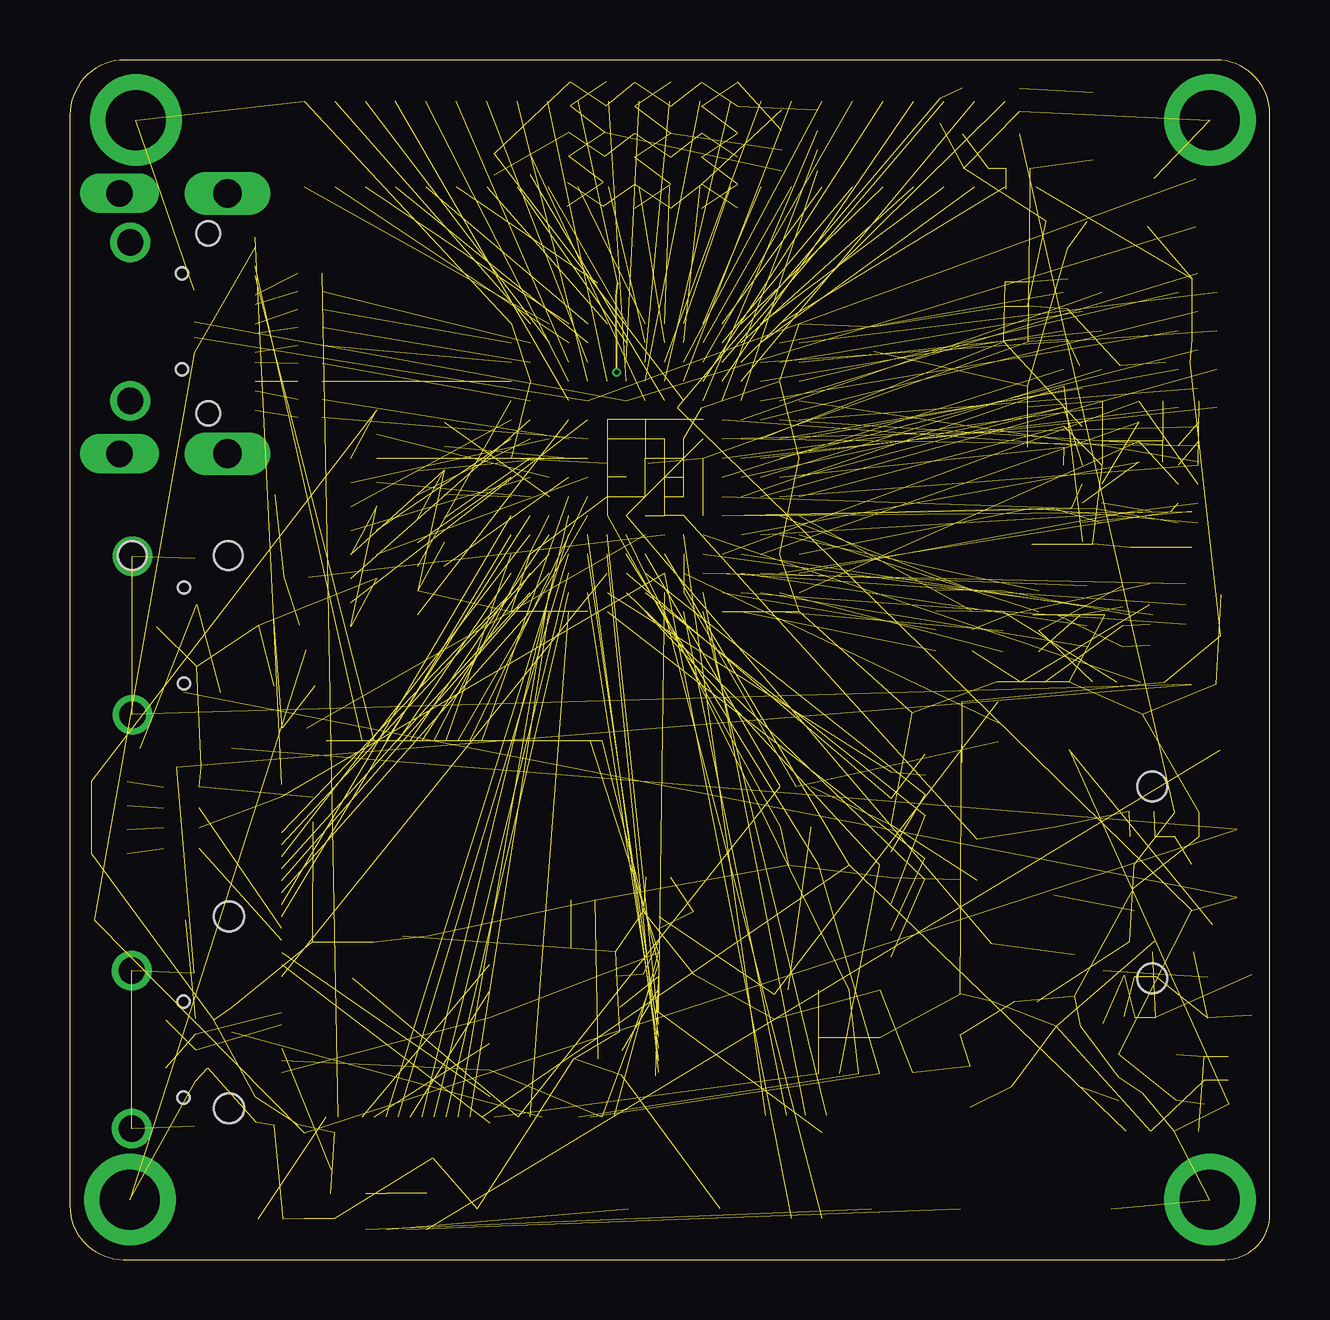
[diagram p7: board, inner layer Route2]
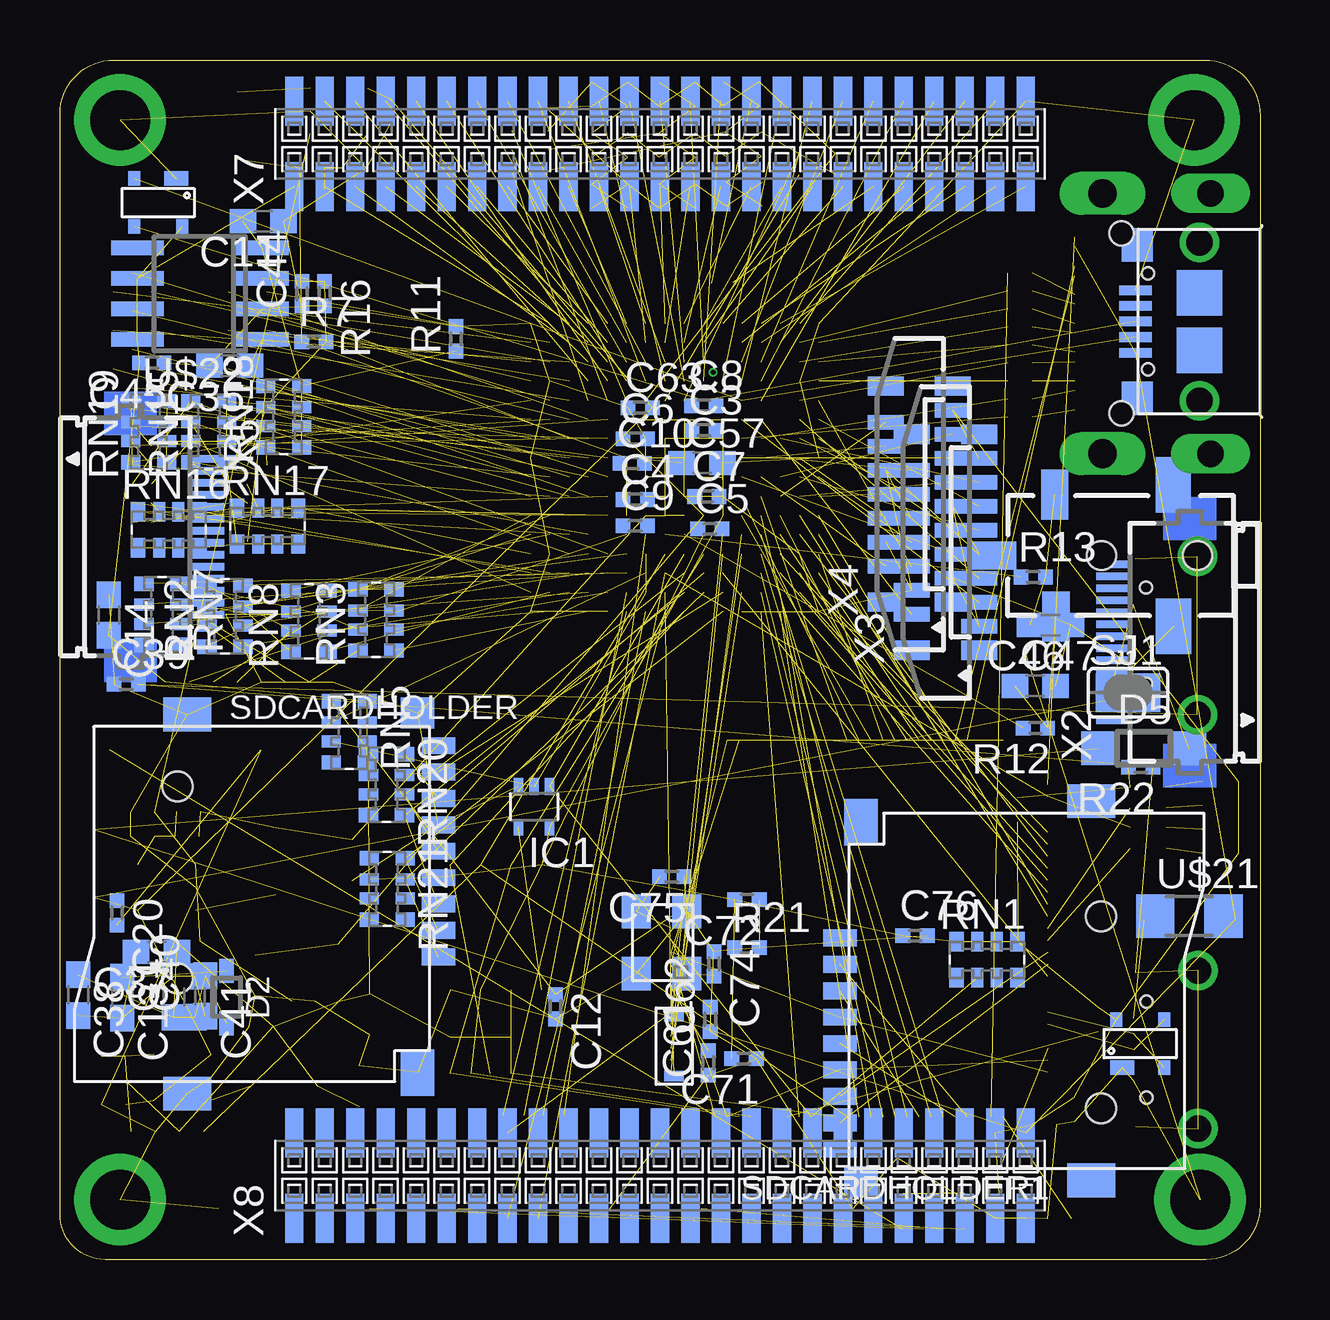
[diagram p8: board, bottom side, seen from below]

Size 50 x 50 mm. Coordinates in mm from the lower left corner, seen from the top.
Outline: 2.24,0 48.12,0 arc90 50,1.88 50,47.76 arc90 47.76,50 2.3,50 arc90 0,47.7 0,2.24 arc90 2.24,0
Copper layers (1*2*15*16): Top 0.035559375mm / dielectric 0.17018125mm / Route2 0.01778125mm / dielectric 47mil / Route15 0.01778125mm / dielectric 0.17018125mm / Bottom 0.035559375mm
Design rules "oshpark-4layer *": minimum track width 3.5mil, minimum drill 0.2mm, track to track 3.5mil, track to pad 5mil, pad to pad 5mil, via to via 5mil, smd to smd 5mil, copper to edge 15mil, drill to drill 3.5mil, minimum pad ring 3mil, minimum via ring 3mil, stop-mask expansion 2.5mil, vias tented up to drill 0mil, thermal gap 10mil
tKeepout: area 55.9,32.5 to 62,38.8

### Footprints (pad centres in the part's own frame; a part is rotated, then mirrored left to right if it is on the bottom)
TACTILE-SWITCH-1101NE = smd 2.3 x 1.6: 1 -3.15,0; 2 3.15,0
C0603 = smd 1.1 x 1: 1 -0.85,0; 2 0.85,0
C0402 = smd 0.61 x 0.61: 1 -0.508,0; 2 0.508,0
SOD-323 = smd 1 x 0.6: A 1.1,0; C -1.1,0
SOD123 = smd 1.4 x 1.4: A 1.9,0; C -1.9,0
SOT143B = smd 1 x 0.6: 1 -0.75,-1 | smd 0.5 x 0.6: 2 1,-1; 3 1,1; 4 -1,1
SC70-5 = smd 0.4 x 0.7: 1 -0.65,-0.85; 2 0,-0.85; 3 0.65,-0.85; 4 0.65,0.85; 5 -0.65,0.85
LQFP100_14X14 = smd 1.2 x 0.3: 1 -7.85,6; 2 -7.85,5.5; 3 -7.85,5; 4 -7.85,4.5; 5 -7.85,4; 6 -7.85,3.5; 7 -7.85,3; 8 -7.85,2.5; 9 -7.85,2; 10 -7.85,1.5; 11 -7.85,1; 12 -7.85,0.5; 13 -7.85,0; 14 -7.85,-0.5; 15 -7.85,-1; 16 -7.85,-1.5; 17 -7.85,-2; 18 -7.85,-2.5; 19 -7.85,-3; 20 -7.85,-3.5; 21 -7.85,-4; 22 -7.85,-4.5; 23 -7.85,-5; 24 -7.85,-5.5; 25 -7.85,-6; 51 7.85,-6; 52 7.85,-5.5; 53 7.85,-5; 54 7.85,-4.5; 55 7.85,-4; 56 7.85,-3.5; 57 7.85,-3; 58 7.85,-2.5; 59 7.85,-2; 60 7.85,-1.5; 61 7.85,-1; 62 7.85,-0.5; 63 7.85,0; 64 7.85,0.5; 65 7.85,1; 66 7.85,1.5; 67 7.85,2; 68 7.85,2.5; 69 7.85,3; 70 7.85,3.5; 71 7.85,4; 72 7.85,4.5; 73 7.85,5; 74 7.85,5.5; 75 7.85,6 | smd 0.3 x 1.2: 26 -6,-7.85; 27 -5.5,-7.85; 28 -5,-7.85; 29 -4.5,-7.85; 30 -4,-7.85; 31 -3.5,-7.85; 32 -3,-7.85; 33 -2.5,-7.85; 34 -2,-7.85; 35 -1.5,-7.85; 36 -1,-7.85; 37 -0.5,-7.85; 38 0,-7.85; 39 0.5,-7.85; 40 1,-7.85; 41 1.5,-7.85; 42 2,-7.85; 43 2.5,-7.85; 44 3,-7.85; 45 3.5,-7.85; 46 4,-7.85; 47 4.5,-7.85; 48 5,-7.85; 49 5.5,-7.85; 50 6,-7.85; 76 6,7.85; 77 5.5,7.85; 78 5,7.85; 79 4.5,7.85; 80 4,7.85; 81 3.5,7.85; 82 3,7.85; 83 2.5,7.85; 84 2,7.85; 85 1.5,7.85; 86 1,7.85; 87 0.5,7.85; 88 0,7.85; 89 -0.5,7.85; 90 -1,7.85; 91 -1.5,7.85; 92 -2,7.85; 93 -2.5,7.85; 94 -3,7.85; 95 -3.5,7.85; 96 -4,7.85; 97 -4.5,7.85; 98 -5,7.85; 99 -5.5,7.85; 100 -6,7.85
TSOP-5/SOT23-5 = smd 0.7 x 1: 1 0.95,1.2; 2 0,1.2; 3 -0.95,1.2; 4 -0.95,-1.2; 5 0.95,-1.2
STEREOJACK2.5MM = smd 1.144 x 2.1: 1 5.898,2.54 | smd 1.998 x 1.17: 3 8.55,0 | smd 1.119 x 2.1: 4 5.949,-2.54 | smd 1.467 x 2.3: 5 1,2.952; A 1.016,-2.952 | hole 1.2: 0,0; 4,0
R0402 = smd 0.61 x 0.61: 1 -0.508,0; 2 0.508,0
EXB38V = smd 0.6 x 0.8: 1 -1.275,-0.75; 4 1.275,-0.75; 5 1.275,0.75; 8 -1.275,0.75 | smd 0.5 x 0.8: 2 -0.4,-0.75; 3 0.4,-0.75; 6 0.4,0.75; 7 -0.4,0.75
TF-PULL = smd 0.7 x 1.4: 1 -2.2,-7.62; 2 -1.1,-7.62; 3 0,-7.62; 4 1.1,-7.62; 5 2.2,-7.62; 6 3.3,-7.62; 7 4.4,-7.62; 8 5.5,-7.62; 9 6.6,-7.62 | smd 1.4 x 2: S1 -7.9,2.85; S2 7.9,2.85 | smd 1.28 x 1.4: S3 7.96,-6.75 | smd 1.95 x 1.4: S4 -7.025,-6.75 | hole 1.25: -3.1,3.25; 4.9,3.25
SJ = smd 1.168 x 1.6: 1 -0.762,0; 2 0.762,0
1206 = smd 1.6 x 1.803: 1 -1.422,0; 2 1.422,0
SOIC-8-NARROW = smd 0.6 x 2.2: 1 -1.905,-2.6; 2 -0.635,-2.6; 3 0.635,-2.6; 4 1.905,-2.6; 5 1.905,2.6; 6 0.635,2.6; 7 -0.635,2.6; 8 -1.905,2.6
FC135 = smd 0.45 x 0.8: P$1 -1.25,0; P$2 1.25,0
WBGA-84 = smd 0.45 x 0.45: A1 -3.2,5.6; A2 -2.4,5.6; A3 -1.6,5.6; A7 1.6,5.6; A8 2.4,5.6; A9 3.2,5.6; B1 -3.2,4.8; B2 -2.4,4.8; B3 -1.6,4.8; B7 1.6,4.8; B8 2.4,4.8; B9 3.2,4.8; C1 -3.2,4; C2 -2.4,4; C3 -1.6,4; C7 1.6,4; C8 2.4,4; C9 3.2,4; D1 -3.2,3.2; D2 -2.4,3.2; D3 -1.6,3.2; D7 1.6,3.2; D8 2.4,3.2; D9 3.2,3.2; E1 -3.2,2.4; E2 -2.4,2.4; E3 -1.6,2.4; E7 1.6,2.4; E8 2.4,2.4; E9 3.2,2.4; F1 -3.2,1.6; F2 -2.4,1.6; F3 -1.6,1.6; F7 1.6,1.6; F8 2.4,1.6; F9 3.2,1.6; G1 -3.2,0.8; G2 -2.4,0.8; G3 -1.6,0.8; G7 1.6,0.8; G8 2.4,0.8; G9 3.2,0.8; H1 -3.2,0; H2 -2.4,0; H3 -1.6,0; H7 1.6,0; H8 2.4,0; H9 3.2,0; J1 -3.2,-0.8; J2 -2.4,-0.8; J3 -1.6,-0.8; J7 1.6,-0.8; J8 2.4,-0.8; J9 3.2,-0.8; K2 -2.4,-1.6; K3 -1.6,-1.6; K7 1.6,-1.6; K8 2.4,-1.6; K9 3.2,-1.6; L1 -3.2,-2.4; L2 -2.4,-2.4; L3 -1.6,-2.4; L7 1.6,-2.4; L8 2.4,-2.4; M2 -2.4,-3.2; M3 -1.6,-3.2; M7 1.6,-3.2; M8 2.4,-3.2; M9 3.2,-3.2; N1 -3.2,-4; N2 -2.4,-4; N3 -1.6,-4; N7 1.6,-4; N8 2.4,-4; P2 -2.4,-4.8; P3 -1.6,-4.8; P7 1.6,-4.8; P8 2.4,-4.8; P9 3.2,-4.8; R1 -3.2,-5.6; R2 -2.4,-5.6; R3 -1.6,-5.6; R7 1.6,-5.6; R8 2.4,-5.6
MICROUSB-B-PEG = smd 0.4 x 1.35: P$1 -1.3,2.675; P$2 -0.65,2.675; P$3 0,2.675; P$4 0.65,2.675; P$5 1.3,2.675 | drill 1.1: SH5 -3.3,0; SH6 3.3,0 | smd 1.4 x 1.3: SH@1 -3.2,2.6; SH@4 3.2,2.6 | smd 1.9 x 1.9: SH@2 -1.2,0; SH@3 1.2,0 | hole 0.5: -2,2.15; 2,2.15
2.5MM-HOLE = drill 2.5 pad 3.81: P$1 0,0
DUAL-0603 = smd 0.8 x 0.65: A1 0.75,0.5; A2 0.75,-0.5; C1 -0.75,0.5; C2 -0.75,-0.5
MINI-HDMI = smd 0.2 x 1.2: 1 3.6,3.525; 2 3.2,3.525; 3 2.8,3.525; 4 2.4,3.525; 5 2,3.525; 6 1.6,3.525; 7 1.2,3.525; 8 0.8,3.525; 9 0.4,3.525; 10 0,3.525; 11 -0.4,3.525; 12 -0.8,3.525; 13 -1.2,3.525; 14 -1.6,3.525; 15 -2,3.525; 16 -2.4,3.525; 17 -2.8,3.525; 18 -3.2,3.525; 19 -3.6,3.525 | drill 1.2 pad 1.35 long: P$20 -5.425,2.375; P$21 5.425,2.375 | drill 1.1 pad 1.3 long: P$22 -5.425,-2.125; P$23 5.425,-2.125 | hole 1: -3.75,1.575; 3.75,1.575
CABGA256 = smd 0.35 x 0.35: A1 -6,6; A2 -5.2,6; A3 -4.4,6; A4 -3.6,6; A5 -2.8,6; A6 -2,6; A7 -1.2,6; A8 -0.4,6; A9 0.4,6; A10 1.2,6; A11 2,6; A12 2.8,6; A13 3.6,6; A14 4.4,6; A15 5.2,6; A16 6,6; B1 -6,5.2; B2 -5.2,5.2; B3 -4.4,5.2; B4 -3.6,5.2; B5 -2.8,5.2; B6 -2,5.2; B7 -1.2,5.2; B8 -0.4,5.2; B9 0.4,5.2; B10 1.2,5.2; B11 2,5.2; B12 2.8,5.2; B13 3.6,5.2; B14 4.4,5.2; B15 5.2,5.2; B16 6,5.2; C1 -6,4.4; C2 -5.2,4.4; C3 -4.4,4.4; C4 -3.6,4.4; C5 -2.8,4.4; C6 -2,4.4; C7 -1.2,4.4; C8 -0.4,4.4; C9 0.4,4.4; C10 1.2,4.4; C11 2,4.4; C12 2.8,4.4; C13 3.6,4.4; C14 4.4,4.4; C15 5.2,4.4; C16 6,4.4; D1 -6,3.6; D2 -5.2,3.6; D3 -4.4,3.6; D4 -3.6,3.6; D5 -2.8,3.6; D6 -2,3.6; D7 -1.2,3.6; D8 -0.4,3.6; D9 0.4,3.6; D10 1.2,3.6; D11 2,3.6; D12 2.8,3.6; D13 3.6,3.6; D14 4.4,3.6; D15 5.2,3.6; D16 6,3.6; E1 -6,2.8; E2 -5.2,2.8; E3 -4.4,2.8; E4 -3.6,2.8; E5 -2.8,2.8; E6 -2,2.8; E7 -1.2,2.8; E8 -0.4,2.8; E9 0.4,2.8; E10 1.2,2.8; E11 2,2.8; E12 2.8,2.8; E13 3.6,2.8; E14 4.4,2.8; E15 5.2,2.8; E16 6,2.8; F1 -6,2; F2 -5.2,2; F3 -4.4,2; F4 -3.6,2; F5 -2.8,2; F6 -2,2; F7 -1.2,2; F8 -0.4,2; F9 0.4,2; F10 1.2,2; F11 2,2; F12 2.8,2; F13 3.6,2; F14 4.4,2; F15 5.2,2; F16 6,2; G1 -6,1.2; G2 -5.2,1.2; G3 -4.4,1.2; G4 -3.6,1.2; G5 -2.8,1.2; G6 -2,1.2; G7 -1.2,1.2; G8 -0.4,1.2; G9 0.4,1.2; G10 1.2,1.2; G11 2,1.2; G12 2.8,1.2; G13 3.6,1.2; G14 4.4,1.2; G15 5.2,1.2; G16 6,1.2; H1 -6,0.4; H2 -5.2,0.4; H3 -4.4,0.4; H4 -3.6,0.4; H5 -2.8,0.4; H6 -2,0.4; H7 -1.2,0.4; H8 -0.4,0.4; H9 0.4,0.4; H10 1.2,0.4; H11 2,0.4; H12 2.8,0.4; H13 3.6,0.4; H14 4.4,0.4; H15 5.2,0.4; H16 6,0.4; J1 -6,-0.4; J2 -5.2,-0.4; J3 -4.4,-0.4; J4 -3.6,-0.4; J5 -2.8,-0.4; J6 -2,-0.4; J7 -1.2,-0.4; J8 -0.4,-0.4; J9 0.4,-0.4; J10 1.2,-0.4; J11 2,-0.4; J12 2.8,-0.4; J13 3.6,-0.4; J14 4.4,-0.4; J15 5.2,-0.4; J16 6,-0.4; K1 -6,-1.2; K2 -5.2,-1.2; K3 -4.4,-1.2; K4 -3.6,-1.2; K5 -2.8,-1.2; K6 -2,-1.2; K7 -1.2,-1.2; K8 -0.4,-1.2; K9 0.4,-1.2; K10 1.2,-1.2; K11 2,-1.2; K12 2.8,-1.2; K13 3.6,-1.2; K14 4.4,-1.2; K15 5.2,-1.2; K16 6,-1.2; L1 -6,-2; L2 -5.2,-2; L3 -4.4,-2; L4 -3.6,-2; L5 -2.8,-2; L6 -2,-2; L7 -1.2,-2; L8 -0.4,-2; L9 0.4,-2; L10 1.2,-2; L11 2,-2; L12 2.8,-2; L13 3.6,-2; L14 4.4,-2; L15 5.2,-2; L16 6,-2; M1 -6,-2.8; M2 -5.2,-2.8; M3 -4.4,-2.8; M4 -3.6,-2.8; M5 -2.8,-2.8; M6 -2,-2.8; M7 -1.2,-2.8; M8 -0.4,-2.8; M9 0.4,-2.8; M10 1.2,-2.8; M11 2,-2.8; M12 2.8,-2.8; M13 3.6,-2.8; M14 4.4,-2.8; M15 5.2,-2.8; M16 6,-2.8; N1 -6,-3.6; N2 -5.2,-3.6; N3 -4.4,-3.6; N4 -3.6,-3.6; N5 -2.8,-3.6; N6 -2,-3.6; N7 -1.2,-3.6; N8 -0.4,-3.6; N9 0.4,-3.6; N10 1.2,-3.6; N11 2,-3.6; N12 2.8,-3.6; N13 3.6,-3.6; N14 4.4,-3.6; N15 5.2,-3.6; N16 6,-3.6; P1 -6,-4.4; P2 -5.2,-4.4; P3 -4.4,-4.4; P4 -3.6,-4.4; P5 -2.8,-4.4; P6 -2,-4.4; P7 -1.2,-4.4; P8 -0.4,-4.4; P9 0.4,-4.4; P10 1.2,-4.4; P11 2,-4.4; P12 2.8,-4.4; P13 3.6,-4.4; P14 4.4,-4.4; P15 5.2,-4.4; P16 6,-4.4; R1 -6,-5.2; R2 -5.2,-5.2; R3 -4.4,-5.2; R4 -3.6,-5.2; R5 -2.8,-5.2; R6 -2,-5.2; R7 -1.2,-5.2; R8 -0.4,-5.2; R9 0.4,-5.2; R10 1.2,-5.2; R11 2,-5.2; R12 2.8,-5.2; R13 3.6,-5.2; R14 4.4,-5.2; R15 5.2,-5.2; R16 6,-5.2; T1 -6,-6; T2 -5.2,-6; T3 -4.4,-6; T4 -3.6,-6; T5 -2.8,-6; T6 -2,-6; T7 -1.2,-6; T8 -0.4,-6; T9 0.4,-6; T10 1.2,-6; T11 2,-6; T12 2.8,-6; T13 3.6,-6; T14 4.4,-6; T15 5.2,-6; T16 6,-6
NRC4018 = smd 1.2 x 3.7: P$1 -1.4,0; P$2 1.4,0
24-QFN = smd 0.69 x 0.28: 1 -1.81,1.25; 2 -1.81,0.75; 3 -1.81,0.25; 4 -1.81,-0.25; 5 -1.81,-0.75; 6 -1.81,-1.25; 13 1.81,-1.25; 14 1.81,-0.75; 15 1.81,-0.25; 16 1.81,0.25; 17 1.81,0.75; 18 1.81,1.25 | smd 0.28 x 0.69: 7 -1.25,-1.81; 8 -0.75,-1.81; 9 -0.25,-1.81; 10 0.25,-1.81; 11 0.75,-1.81; 12 1.25,-1.81; 19 1.25,1.81; 20 0.75,1.81; 21 0.25,1.81; 22 -0.25,1.81; 23 -0.75,1.81; 24 -1.25,1.81 | smd 2.5 x 2.5: PAD 0,0
52559-1592 = smd 0.6 x 1.5: 1 -3.5,-1.4; 2 -3,1.4; 3 -2.5,-1.4; 4 -2,1.4; 5 -1.5,-1.4; 6 -1,1.4; 7 -0.5,-1.4; 8 0,1.4; 9 0.5,-1.4; 10 1,1.4; 11 1.5,-1.4; 12 2,1.4; 13 2.5,-1.4; 14 3,1.4; 15 3.5,-1.4 | smd 0.8 x 1.5: M1 -4.5,-1.4; M2 4.5,-1.4; M3 4.5,1.4; M4 -4.5,1.4
FH12-14S-0.5SH = smd 0.3 x 1.3: 1 -3.25,3.25; 2 -2.75,3.25; 3 -2.25,3.25; 4 -1.75,3.25; 5 -1.25,3.25; 6 -0.75,3.25; 7 -0.25,3.25; 8 0.25,3.25; 9 0.75,3.25; 10 1.25,3.25; 11 1.75,3.25; 12 2.25,3.25; 13 2.75,3.25; 14 3.25,3.25
1296-50 = smd 0.76 x 2.05: 1 -15.24,-1.78; 2 -15.24,1.78; 3 -13.97,-1.78; 4 -13.97,1.78; 5 -12.7,-1.78; 6 -12.7,1.78; 7 -11.43,-1.78; 8 -11.43,1.78; 9 -10.16,-1.78; 10 -10.16,1.78; 11 -8.89,-1.78; 12 -8.89,1.78; 13 -7.62,-1.78; 14 -7.62,1.78; 15 -6.35,-1.78; 16 -6.35,1.78; 17 -5.08,-1.78; 18 -5.08,1.78; 19 -3.81,-1.78; 20 -3.81,1.78; 21 -2.54,-1.78; 22 -2.54,1.78; 23 -1.27,-1.78; 24 -1.27,1.78; 25 0,-1.78; 26 0,1.78; 27 1.27,-1.78; 28 1.27,1.78; 29 2.54,-1.78; 30 2.54,1.78; 31 3.81,-1.78; 32 3.81,1.78; 33 5.08,-1.78; 34 5.08,1.78; 35 6.35,-1.78; 36 6.35,1.78; 37 7.62,-1.78; 38 7.62,1.78; 39 8.89,-1.78; 40 8.89,1.78; 41 10.16,-1.78; 42 10.16,1.78; 43 11.43,-1.78; 44 11.43,1.78; 45 12.7,-1.78; 46 12.7,1.78; 47 13.97,-1.78; 48 13.97,1.78; 49 15.24,-1.78; 50 15.24,1.78
CRYSTAL-3.2X2.5 = smd 1.4 x 1.2: 1 -1.3,-1; 2 1.3,-1; 3 1.3,1.1; 4 -1.3,1.1

### Placement (x,y rotation side)
B1  30.25,2.12 0 top
B2  20.12,2.12 0 top
B3  40.25,2.12 180 top
B4  44.78,21.24 0 top
C1  45.25,10.94 90 bottom
C2  44.65,18.68 180 top
C3  23.17,34.57 0 bottom
C4  26.04,31.67 0 bottom
C5  22.92,30.46 0 bottom
C6  26.04,34.21 0 bottom
C7  23.04,31.8 0 bottom
C8  23.17,35.59 0 bottom
C9  26.04,30.59 0 bottom
C10  26.16,33.19 0 bottom
C11  41.53,43.28 180 bottom
C12  29.35,10.54 270 bottom
C13  47.41,10.92 270 bottom
C14  47.96,26.87 270 bottom
C15  37.09,10.21 270 top
C16  37.82,16.66 270 top
C17  37.53,7.22 90 top
C18  36.25,47.88 90 top
C19  39.5,45.5 0 top
C20  47.63,14.45 270 bottom
C23  10,35.12 180 top
C24  10,35.88 180 top
C25  10,36.62 180 top
C26  10,37.38 180 top
C27  10,38.12 180 top
C28  10,38.88 0 top
C29  10,39.62 180 top
C30  10,40.38 180 top
C33  46.55,18.63 180 top
C35  42.92,37.26 180 bottom
C36  41.86,11.84 270 top
C37  45.98,12.82 180 bottom
C38  49.25,11.02 270 bottom
C39  47.24,23.98 0 bottom
C40  44.38,10.95 90 bottom
C41  43.94,10.99 270 bottom
C42  47.78,6.47 180 top
C43  47.28,7.97 270 top
C44  39.92,40.26 90 bottom
C45  46.17,37.38 180 bottom
C46  8.73,26.44 180 bottom
C47  9.36,23.92 0 bottom
C48  41.61,9.71 180 top
C57  23.25,33.19 0 bottom
C61  22.99,8.19 90 bottom
C62  22.91,10.01 90 bottom
C63  25.82,35.51 0 bottom
C67  15.62,4.25 0 top
C68  7.75,6.25 90 top
C69  10.12,18.75 270 top
C70  9,5.62 0 top
C71  21.5,8.38 180 bottom
C72  21.38,15 180 bottom
C74  22.75,12.33 270 bottom
C75  24.51,15.96 180 bottom
C76  14.38,13.5 0 bottom
D2  43.06,10.94 270 bottom
D3  2.93,14.16 0 top
D5  4.84,21.31 0 bottom
ESD1  45.91,44.05 180 bottom
ESD2  5,9 0 bottom
IC1  30.25,18.88 180 bottom
IC3  16.69,13.79 180 top
IC7  39.36,11.96 180 top
J1  2.6,29.34 180 bottom
R1  44.67,13.26 180 top
R2  39.5,44.62 0 top
R3  44.7,17.63 180 top
R4  37.75,45.5 180 top
R5  46.55,17.63 0 top
R6  44.53,5.34 0 top
R7  39.42,38.26 0 bottom
R9  48.28,7.97 270 top
R10  46.53,5.34 180 top
R11  33.5,38.38 90 bottom
R12  9.36,22.15 180 bottom
R13  9.44,28.45 0 bottom
R15  10,41.12 0 top
R16  38.97,40.26 270 bottom
R21  21.38,13 0 bottom
R22  4.97,20.52 180 bottom
R24  8.36,1.7 180 top
R25  10.88,3.25 90 top
R26  6.75,10 90 top
RN1  11.38,12.5 0 bottom
RN2  43.13,26.82 90 bottom
RN3  36.83,26.66 90 bottom
RN4  30.26,5.27 180 top
RN5  37.95,21.99 270 bottom
RN6  32.47,8.51 0 top
RN7  45.75,26.89 270 bottom
RN8  39.63,26.61 90 bottom
RN9  30.41,46.65 90 top
RN10  18.44,46.5 90 top
RN13  13.61,2.01 180 top
RN14  4.65,18.42 90 top
RN15  43.8,34.51 90 bottom
RN16  45.47,30.42 0 bottom
RN17  41.35,30.57 0 bottom
RN18  40.67,35.13 90 bottom
RN19  46.3,34.51 90 bottom
RN20  36.4,19.8 270 bottom
RN21  36.37,15.45 270 bottom
SDCARDHOLDER  41.85,14.82 90 bottom
SDCARDHOLDER1  9.88,11.2 270 bottom
SJ1  5.5,23.63 0 bottom
U$1  48.63,16.51 270 top
U$2  31.84,13.85 0 top
U$3  24.42,8.9 90 bottom
U$4  44.59,35.52 0 top
U$5  2.58,8.75 270 top
U$6  2.61,26.01 270 top
U$7  2.75,47.5 0 top
U$8  1.65,17.42 180 top
U$9  4.19,39.01 270 top
U$10  1.65,19.42 180 top
U$11  2.52,39.1 90 bottom
U$12  38.38,47.88 270 top
U$13  45.55,15.51 90 top
U$14  24.39,33.01 0 top
U$15  47.5,47.5 0 top
U$16  2.5,2.5 0 top
U$17  47.5,2.5 0 top
U$18  41.02,16.61 90 top
U$19  42.62,47.25 270 top
U$20  44.9,7.59 90 top
U$21  2.94,14.32 0 bottom
U$22  44.17,40.26 90 bottom
U$23  40.65,7.22 180 top
U$25  9.83,25.4 0 top
U$28  21.61,48.6 0 top
U$29  24.28,48.57 0 top
U$30  27.09,48.57 0 top
U$31  21.53,46.5 0 top
U$32  24.28,46.45 0 top
U$33  27.09,46.45 0 top
U$34  21.48,44.4 0 top
U$35  24.28,44.32 0 top
U$36  27.09,44.32 0 top
X1  42.11,25.48 0 top
X2  2.92,25.73 90 bottom
X3  13.11,29.9 90 bottom
X4  14.2,31.9 90 bottom
X5  47.07,30.12 270 bottom
X6  14.43,31.93 90 top
X7  25,46.5 0 bottom
X8  25,3.5 0 bottom
Y3  24.89,13.21 90 bottom

### Tracks (layer width: path | path; a pad name or v marks a point on that pad's centre or on a via)
5V  (8 unrouted)
25M  (1 unrouted)
!B1  (1 unrouted)
!B2  (1 unrouted)
!B3  (1 unrouted)
!B4  (1 unrouted)
!CAS  (1 unrouted)
!CFG  (1 unrouted)
!CK  (1 unrouted)
!CS  (2 unrouted)
!INIT  (1 unrouted)
!LDQS  (1 unrouted)
!PROG  (2 unrouted)
!RAS  (2 unrouted)
!RESET  (2 unrouted)
!SS  (3 unrouted)
!UDQS  (1 unrouted)
!WE  (2 unrouted)
+1V8  (10 unrouted)
+2V5  (3 unrouted)
+3V3  (62 unrouted)
+5V  (5 unrouted)
A0  (2 unrouted)
A1  (2 unrouted)
A2  (2 unrouted)
A3  (2 unrouted)
A4  (2 unrouted)
A5  (2 unrouted)
A6  (2 unrouted)
A7  (2 unrouted)
A8  (2 unrouted)
A9  (2 unrouted)
A10  (2 unrouted)
A11  (2 unrouted)
A12  (2 unrouted)
B0+  (1 unrouted)
B0-  (1 unrouted)
B1+  (1 unrouted)
B2+  (1 unrouted)
B2-  (1 unrouted)
BA0  (2 unrouted)
BA1  (2 unrouted)
BA2  (2 unrouted)
BK+  (1 unrouted)
BK-  (1 unrouted)
BOOT  (1 unrouted)
C1  (1 unrouted)
C2  (1 unrouted)
C3  (1 unrouted)
C4  (6 unrouted)
C5  (6 unrouted)
C6  (6 unrouted)
CEC  (1 unrouted)
CFG  (3 unrouted)
CK  (1 unrouted)
CKE  (1 unrouted)
D+  (2 unrouted)
D-  (2 unrouted)
DONE  (3 unrouted)
DQ0  (1 unrouted)
DQ1  (1 unrouted)
DQ2  (1 unrouted)
DQ3  (1 unrouted)
DQ4  (1 unrouted)
DQ5  (1 unrouted)
DQ6  (1 unrouted)
DQ7  (1 unrouted)
DQ8  (1 unrouted)
DQ9  (1 unrouted)
DQ10  (1 unrouted)
DQ11  (1 unrouted)
DQ12  (1 unrouted)
DQ13  (1 unrouted)
DQ14  (1 unrouted)
DQ15  (1 unrouted)
FA16  (1 unrouted)
FA17  (1 unrouted)
FA18  (1 unrouted)
FA19  (1 unrouted)
FA20  (1 unrouted)
FA21  (1 unrouted)
FA22  (1 unrouted)
FA23  (1 unrouted)
FCLK  (1 unrouted)
FD0  (1 unrouted)
FD1  (1 unrouted)
FD2  (1 unrouted)
FD3  (1 unrouted)
FD4  (1 unrouted)
FD5  (1 unrouted)
FD6  (1 unrouted)
FD7  (1 unrouted)
FD8  (1 unrouted)
FD9  (1 unrouted)
FD10  (1 unrouted)
FD11  (1 unrouted)
FD12  (1 unrouted)
FD13  (1 unrouted)
FD14  (1 unrouted)
FD15  (1 unrouted)
FNE1  (1 unrouted)
FNL  (1 unrouted)
FNOE  (1 unrouted)
FNWE  (1 unrouted)
FWAIT  (1 unrouted)
GND  (110 unrouted)
HCEC  (1 unrouted)
HDM  (2 unrouted)
HDP  (2 unrouted)
HOLD  (3 unrouted)
HPD  (1 unrouted)
L  (1 unrouted)
LDM  (1 unrouted)
LDQS  (1 unrouted)
MISO  (2 unrouted)
MODE  (1 unrouted)
MOSI/D0  (2 unrouted)
MP0+  (1 unrouted)
MP0-  (1 unrouted)
MP1+  (1 unrouted)
MP1-  (1 unrouted)
MP2+  (1 unrouted)
MP2-  (1 unrouted)
MPA  (1 unrouted)
MPB  (1 unrouted)
MPK+  (1 unrouted)
MPK-  (1 unrouted)
N$1  (2 unrouted)
N$3  (4 unrouted)
N$4  (1 unrouted)
N$5  (1 unrouted)
N$6  (1 unrouted)
N$8  (2 unrouted)
N$9  (2 unrouted)
N$10  (3 unrouted)
N$11  (1 unrouted)
N$12  (2 unrouted)
N$13  (1 unrouted)
N$14  (1 unrouted)
N$15  (1 unrouted)
N$16  (1 unrouted)
N$17  (1 unrouted)
N$19  (2 unrouted)
N$20  (2 unrouted)
N$21  (1 unrouted)
N$22  (2 unrouted)
N$23  (1 unrouted)
N$24  (1 unrouted)
N$25  (2 unrouted)
N$26  (2 unrouted)
N$27  (1 unrouted)
N$28  (1 unrouted)
N$29  (1 unrouted)
N$30  (2 unrouted)
N$31  (1 unrouted)
N$32  (1 unrouted)
N$33  (1 unrouted)
N$34  (1 unrouted)
N$35  (1 unrouted)
N$36  (1 unrouted)
N$39  (1 unrouted)
N$40  (1 unrouted)
N$42  (1 unrouted)
N$43  (1 unrouted)
N$44  (1 unrouted)
N$45  (1 unrouted)
N$46  (1 unrouted)
N$47  (3 unrouted)
N$48  (1 unrouted)
N$49  (1 unrouted)
N$50  (1 unrouted)
N$51  (1 unrouted)
N$52  (1 unrouted)
N$53  (1 unrouted)
N$54  (1 unrouted)
N$55  (1 unrouted)
N$56  (1 unrouted)
N$57  (1 unrouted)
N$58  (1 unrouted)
N$60  (2 unrouted)
N$61  (1 unrouted)
N$63  (2 unrouted)
N$69  (1 unrouted)
N$70  (1 unrouted)
N$71  (1 unrouted)
N$72  (1 unrouted)
N$73  (1 unrouted)
N$74  (1 unrouted)
N$75  (1 unrouted)
N$76  (1 unrouted)
N$77  (1 unrouted)
N$78  (1 unrouted)
N$79  (1 unrouted)
N$80  (1 unrouted)
N$81  (1 unrouted)
N$82  (1 unrouted)
N$83  (1 unrouted)
  Top 0.089: U$14.B6 21.97,38.7 21.97,40.72
N$84  (1 unrouted)
N$85  (1 unrouted)
N$86  (1 unrouted)
N$87  (1 unrouted)
N$88  (via drill 0.2)  (1 unrouted)
  Top 0.089: U$14.C6 22.85,36.93 v22.78,36.98
  Route2 0.089: v22.78,36.98 22.76,40.13 22.84,40.69
N$89  (1 unrouted)
N$90  (1 unrouted)
N$91  (3 unrouted)
N$92  (2 unrouted)
N$93  (3 unrouted)
N$94  (1 unrouted)
N$96  (5 unrouted)
N$97  (5 unrouted)
N$98  (2 unrouted)
N$106  (1 unrouted)
N$107  (1 unrouted)
N$108  (1 unrouted)
N$130  (1 unrouted)
N$131  (1 unrouted)
N$132  (1 unrouted)
N$133  (1 unrouted)
N$134  (1 unrouted)
N$135  (1 unrouted)
N$136  (1 unrouted)
N$137  (1 unrouted)
N$138  (1 unrouted)
N$139  (1 unrouted)
N$140  (1 unrouted)
N$141  (1 unrouted)
N$142  (1 unrouted)
N$143  (1 unrouted)
N$144  (1 unrouted)
N$145  (1 unrouted)
N$146  (1 unrouted)
R  (1 unrouted)
R1  (1 unrouted)
R2  (1 unrouted)
R3  (8 unrouted)
R4  (6 unrouted)
R5  (6 unrouted)
SCK  (3 unrouted)
SD0  (2 unrouted)
SD1  (2 unrouted)
SD2  (2 unrouted)
SD3  (2 unrouted)
SDCLK  (2 unrouted)
SDCMD  (2 unrouted)
SDMCLK  (1 unrouted)
SDMCMD  (1 unrouted)
SDMD0  (1 unrouted)
SDMD1  (1 unrouted)
SDMD3  (1 unrouted)
STATUS  (1 unrouted)
SWCLK  (1 unrouted)
SWDIO  (1 unrouted)
TCK  (1 unrouted)
TCK+  (1 unrouted)
TCK-  (1 unrouted)
TD0+  (1 unrouted)
TD0-  (1 unrouted)
TD1+  (1 unrouted)
TD1-  (1 unrouted)
TD2+  (1 unrouted)
TD2-  (1 unrouted)
TDI  (1 unrouted)
TDO  (1 unrouted)
TMS  (1 unrouted)
UDM  (1 unrouted)
UDQS  (1 unrouted)
USHLDA  (13 unrouted)
VBUS  (2 unrouted)
VCC  (9 unrouted)
VDB  (1 unrouted)
VDD  (5 unrouted)
VDQ2  (5 unrouted)
VPP  (1 unrouted)
VSCL  (1 unrouted)
VSDA  (1 unrouted)
VSS  (5 unrouted)
VTRM  (22 unrouted)
WP  (3 unrouted)

### Text on the board
tSilk: Amalgam